# EasyEDA Pro project SAM-2.eprj, schematic Schematic, sheets 1 to 7 of 8

## Sheets
1 Universal Inputs: Board Name: SAM-2; Create Date: 2026-07-06; Page Name: Universal Inputs; Project Name: SAM-2; Schematic Name: Schematic; Update Date: 2026-07-13; Company: www.zyntellitech.com; Drawn: Stephen Long Jr; Page Size: A4; Version: V1.0
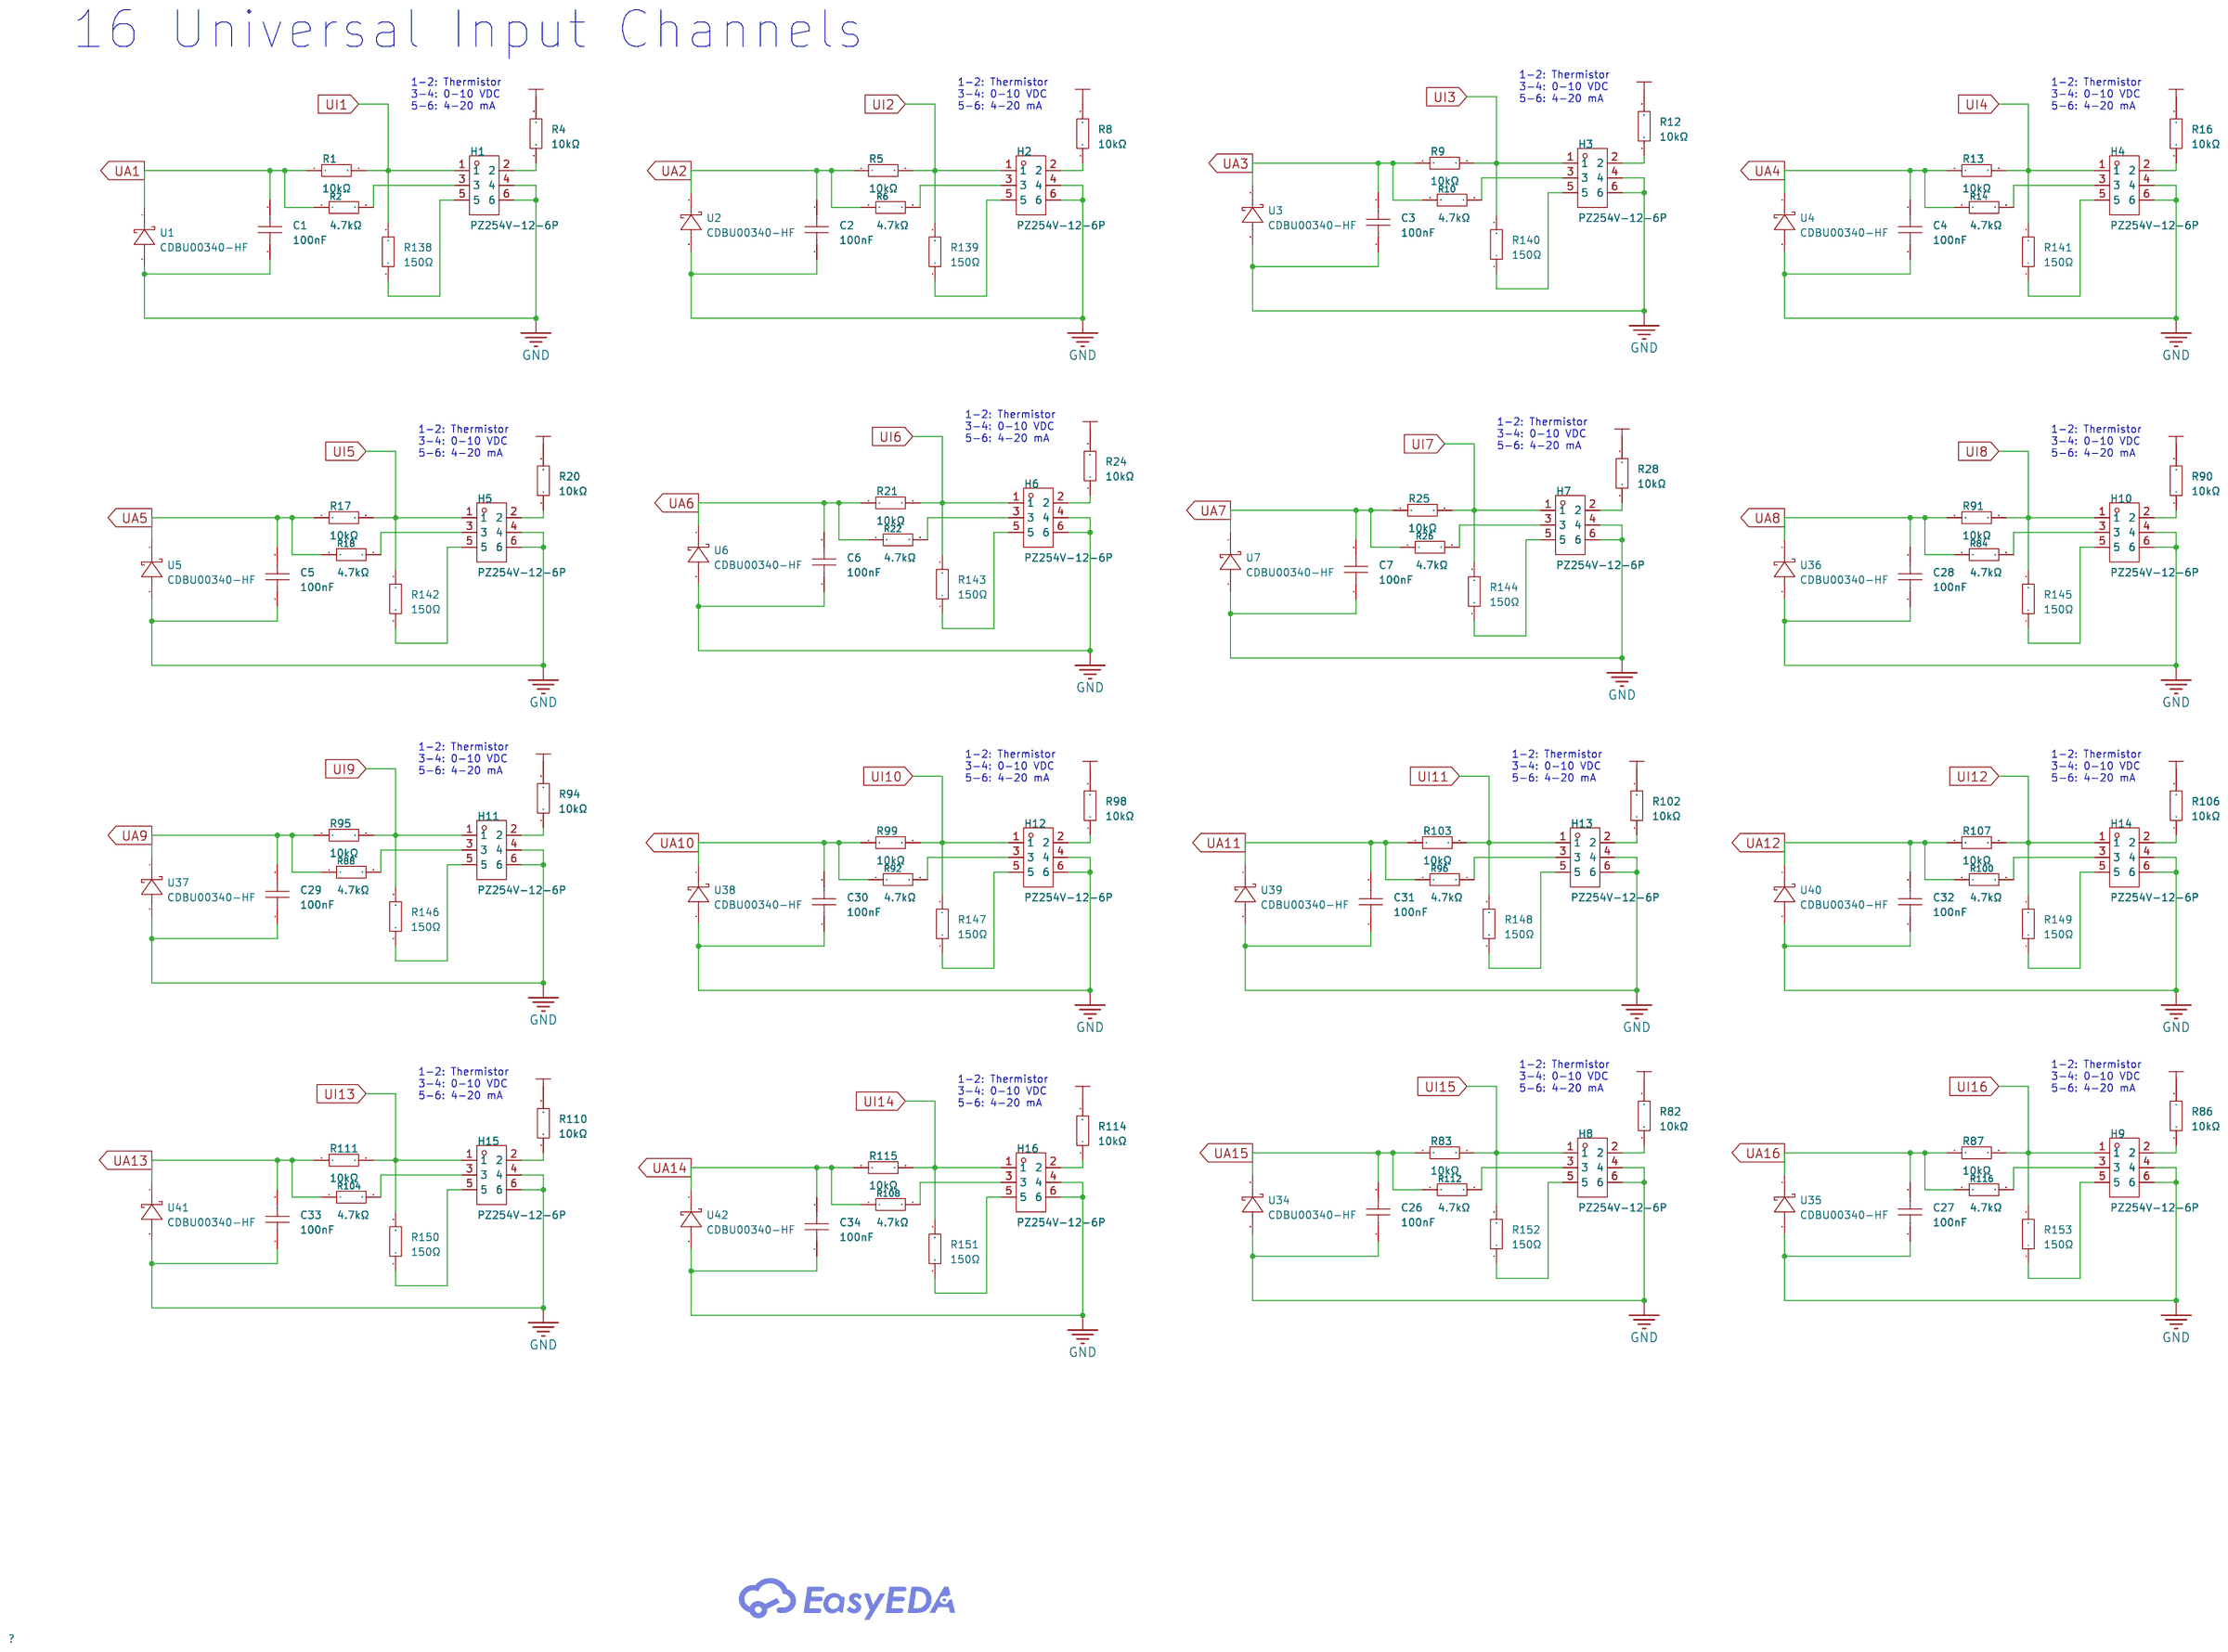
[diagram p0: Universal Inputs]
2 Analog Outputs: Create Date: 2026-07-07; Page Name: Analog Outputs; Update Date: 2026-07-08; Company: EasyEDA.com
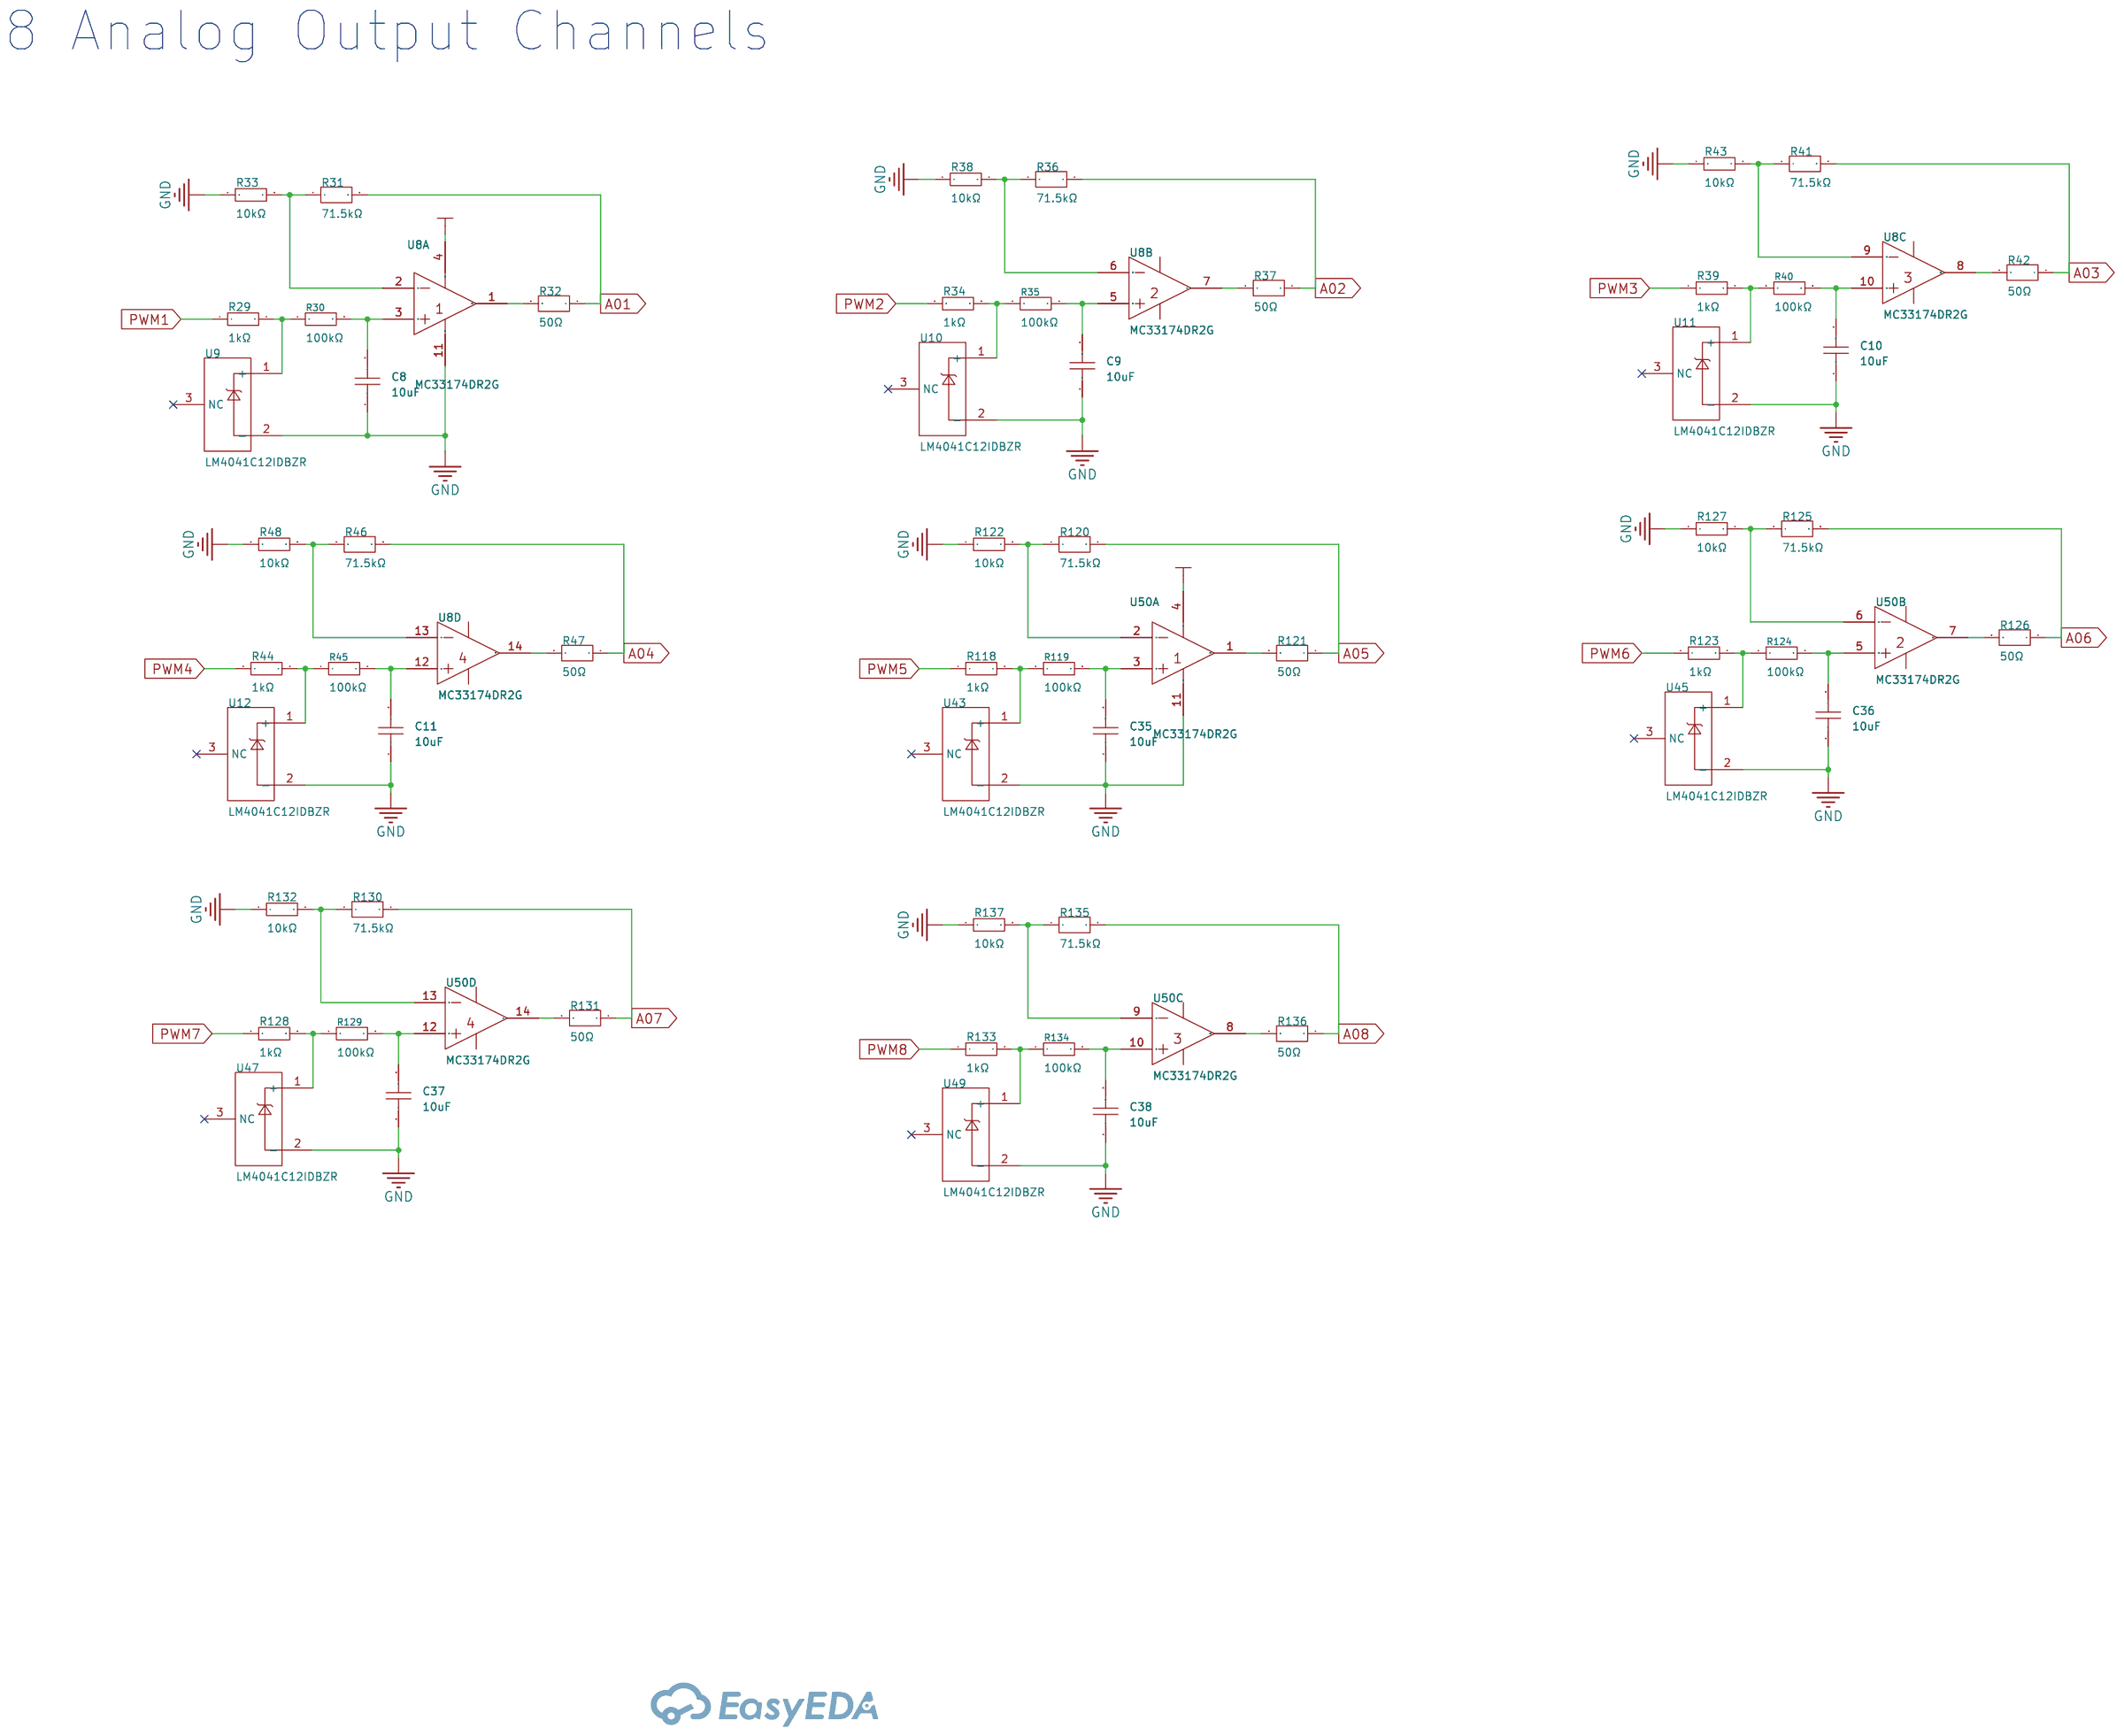
[diagram p1: Analog Outputs]
3 Triac: Create Date: 2026-07-08; Page Name: Triac; Update Date: 2026-07-08; Company: EasyEDA.com
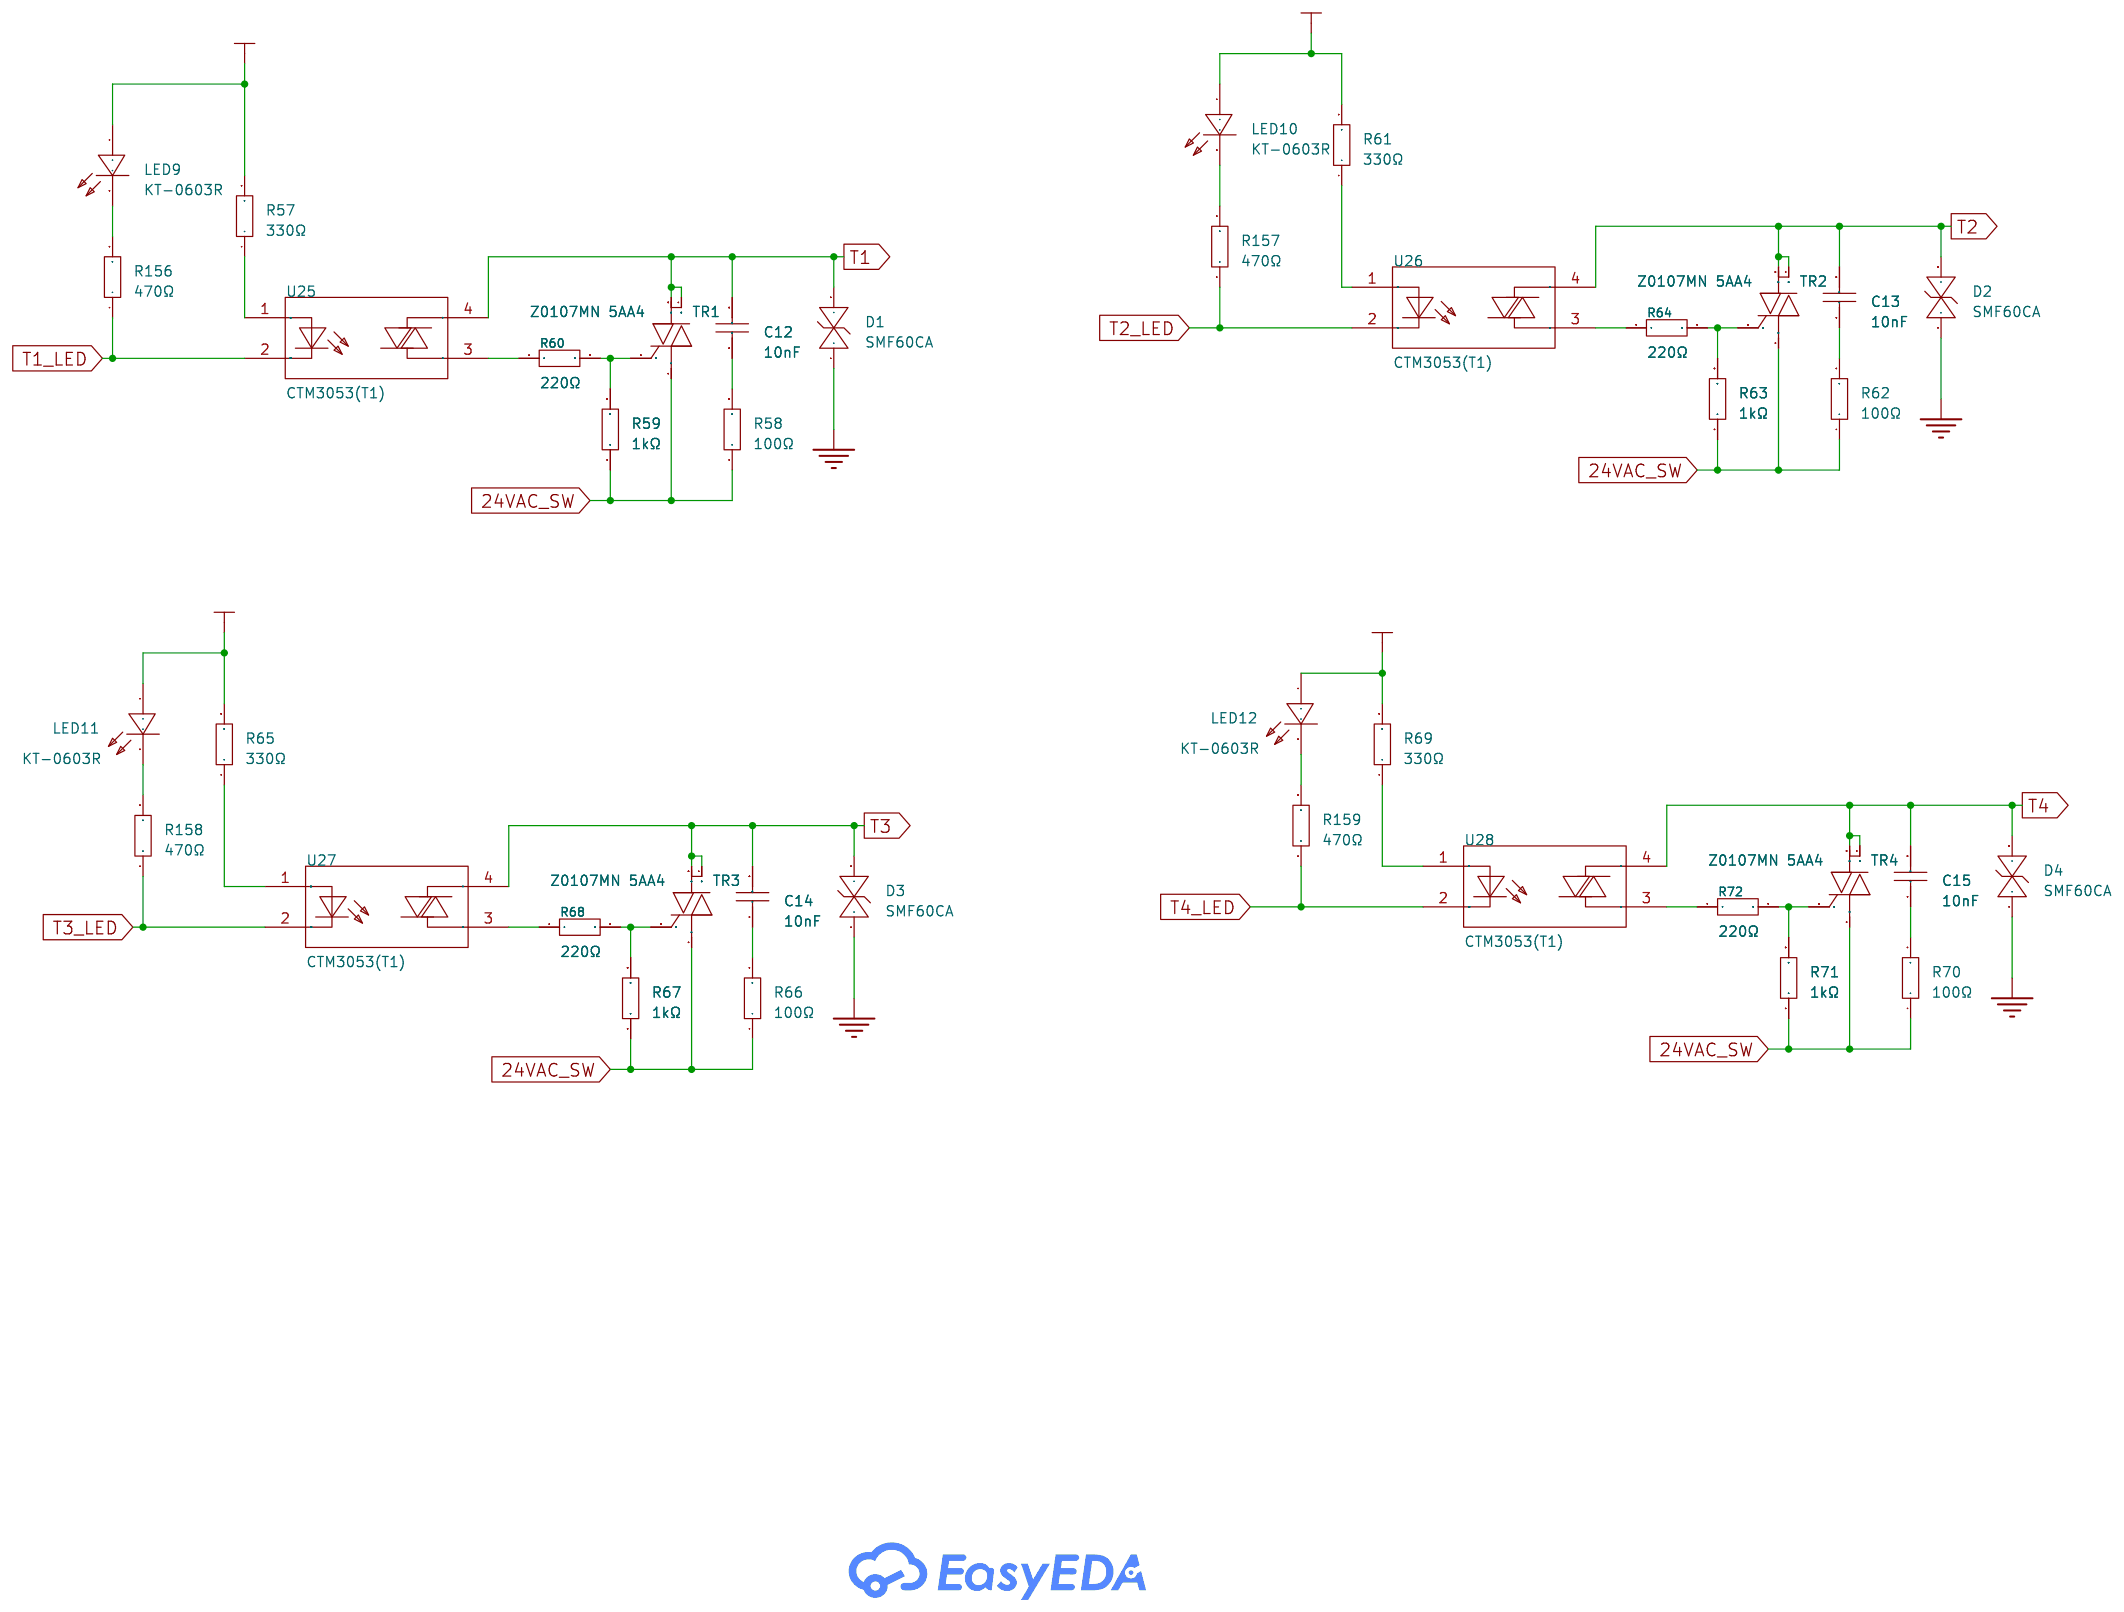
[diagram p2: Triac]
4 FastDigital: Create Date: 2026-07-08; Page Name: FastDigital; Update Date: 2026-07-08; Company: EasyEDA.com
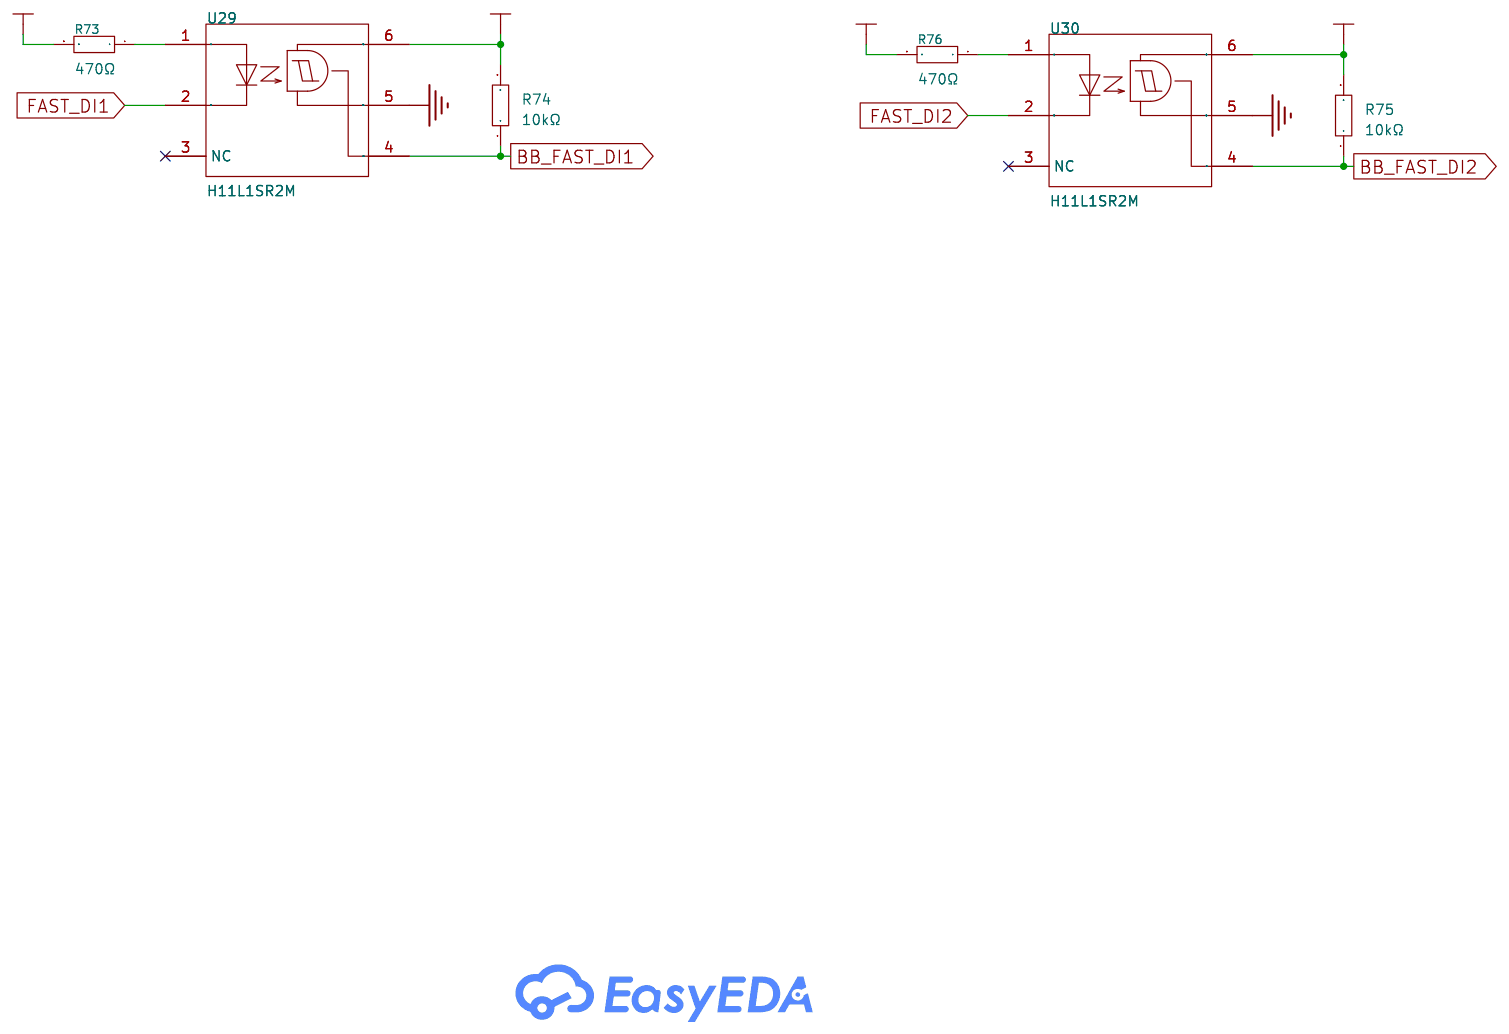
[diagram p3: FastDigital]
5 Power Circuit: Create Date: 2026-07-08; Page Name: Power Circuit; Update Date: 2026-07-15; Company: EasyEDA.com
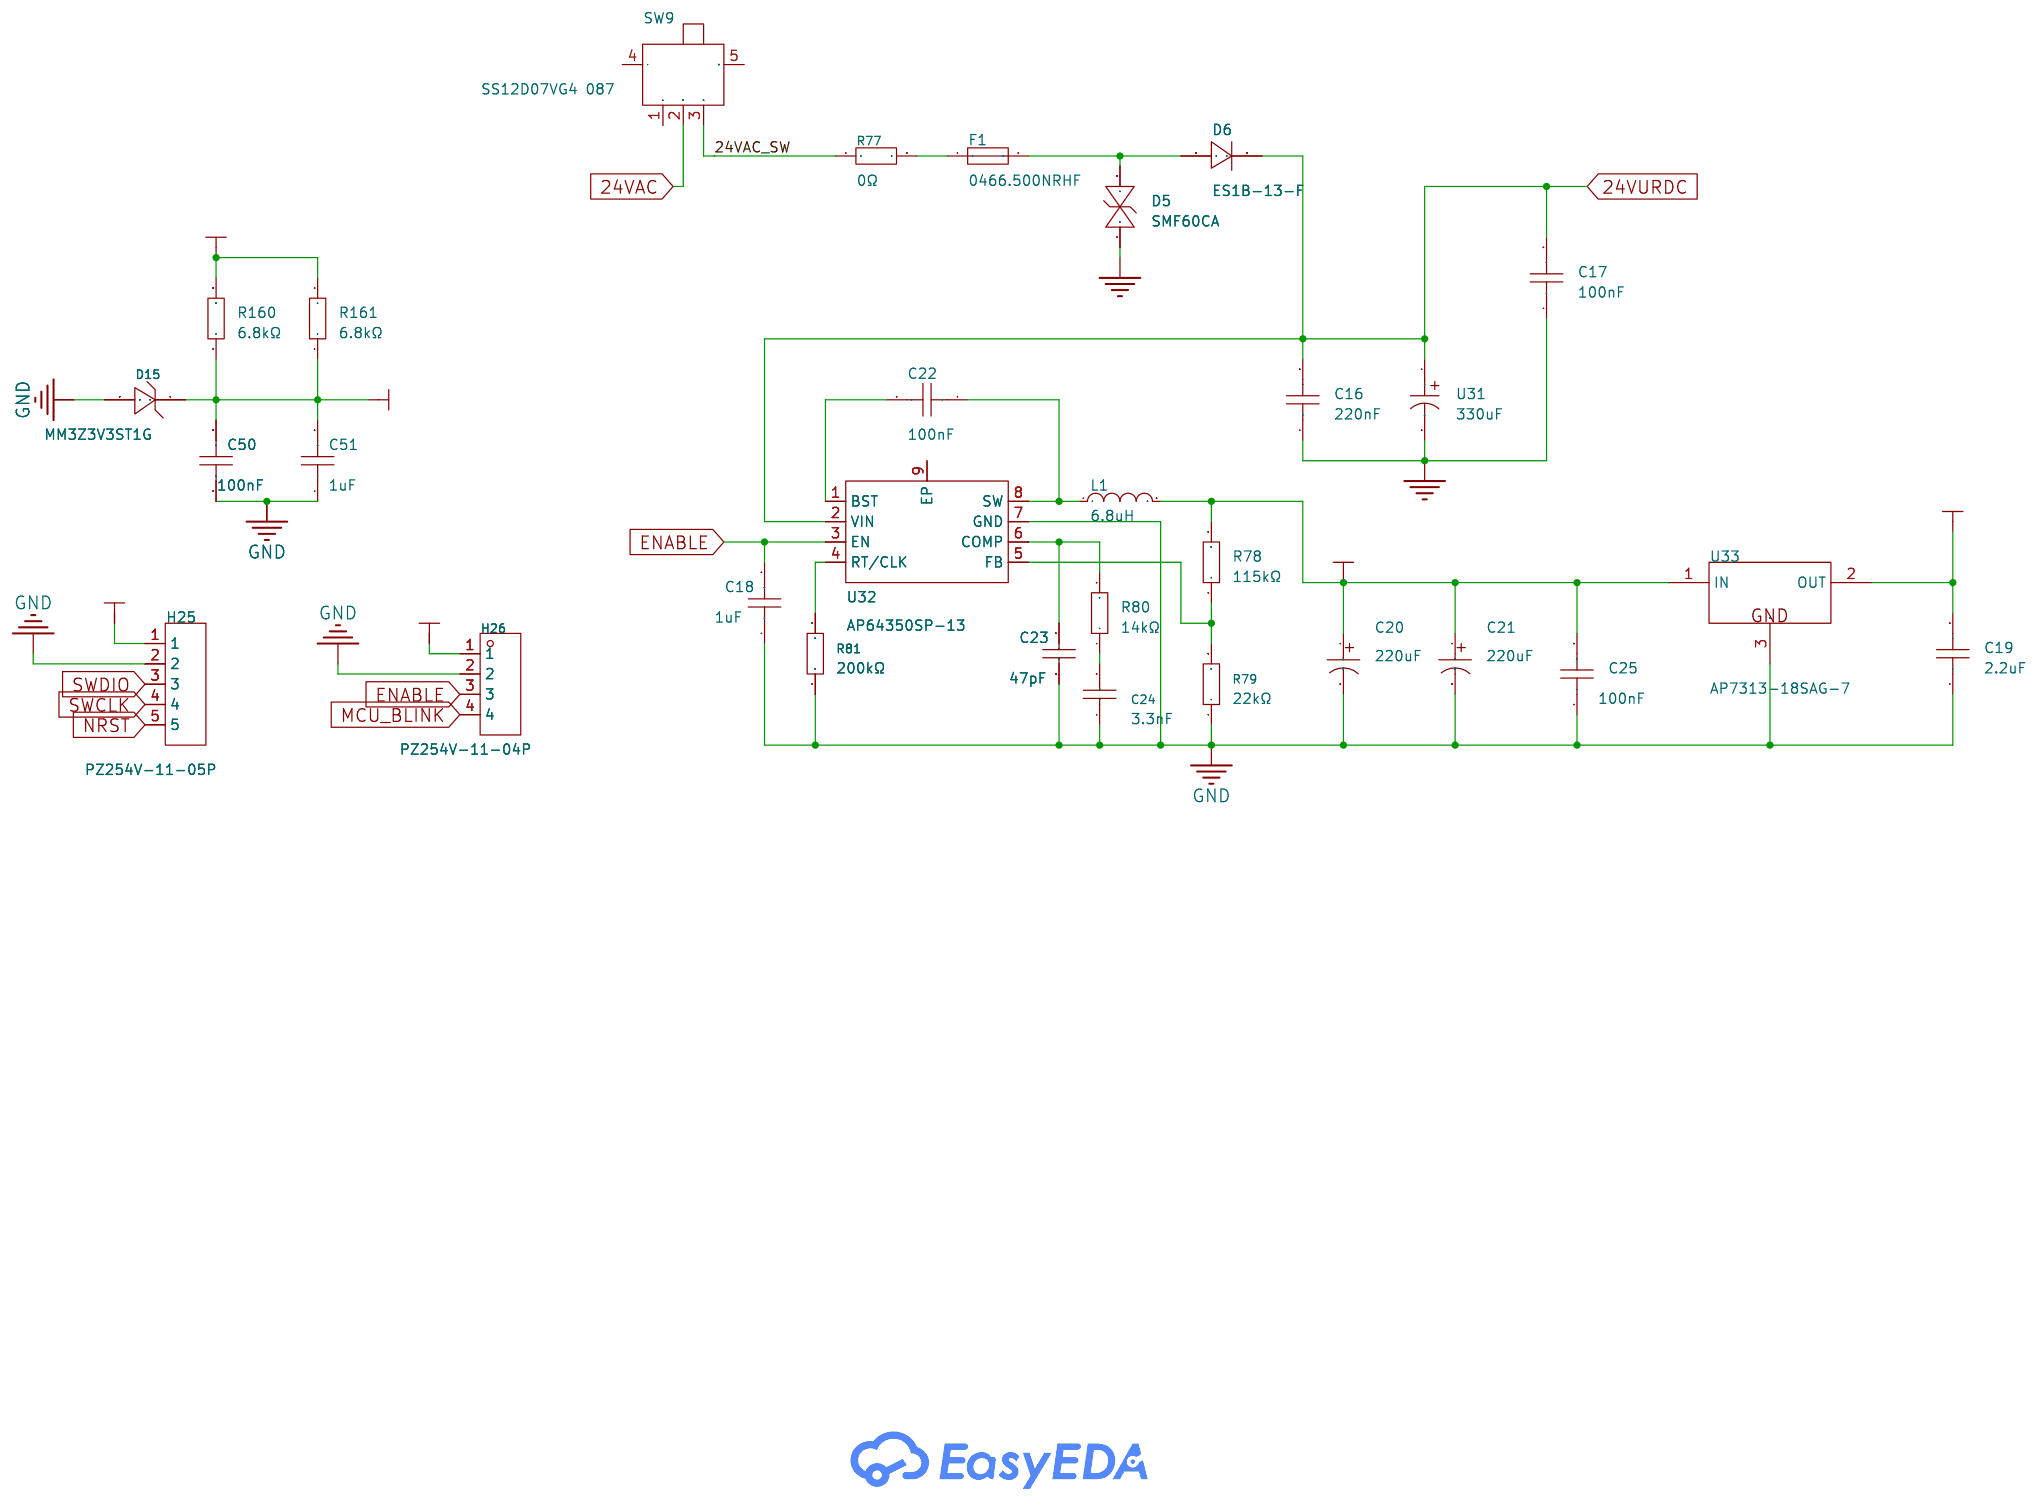
[diagram p4: Power Circuit]
6 Microcontroller: Create Date: 2026-07-09; Page Name: Microcontroller; Update Date: 2026-07-15; Company: EasyEDA.com
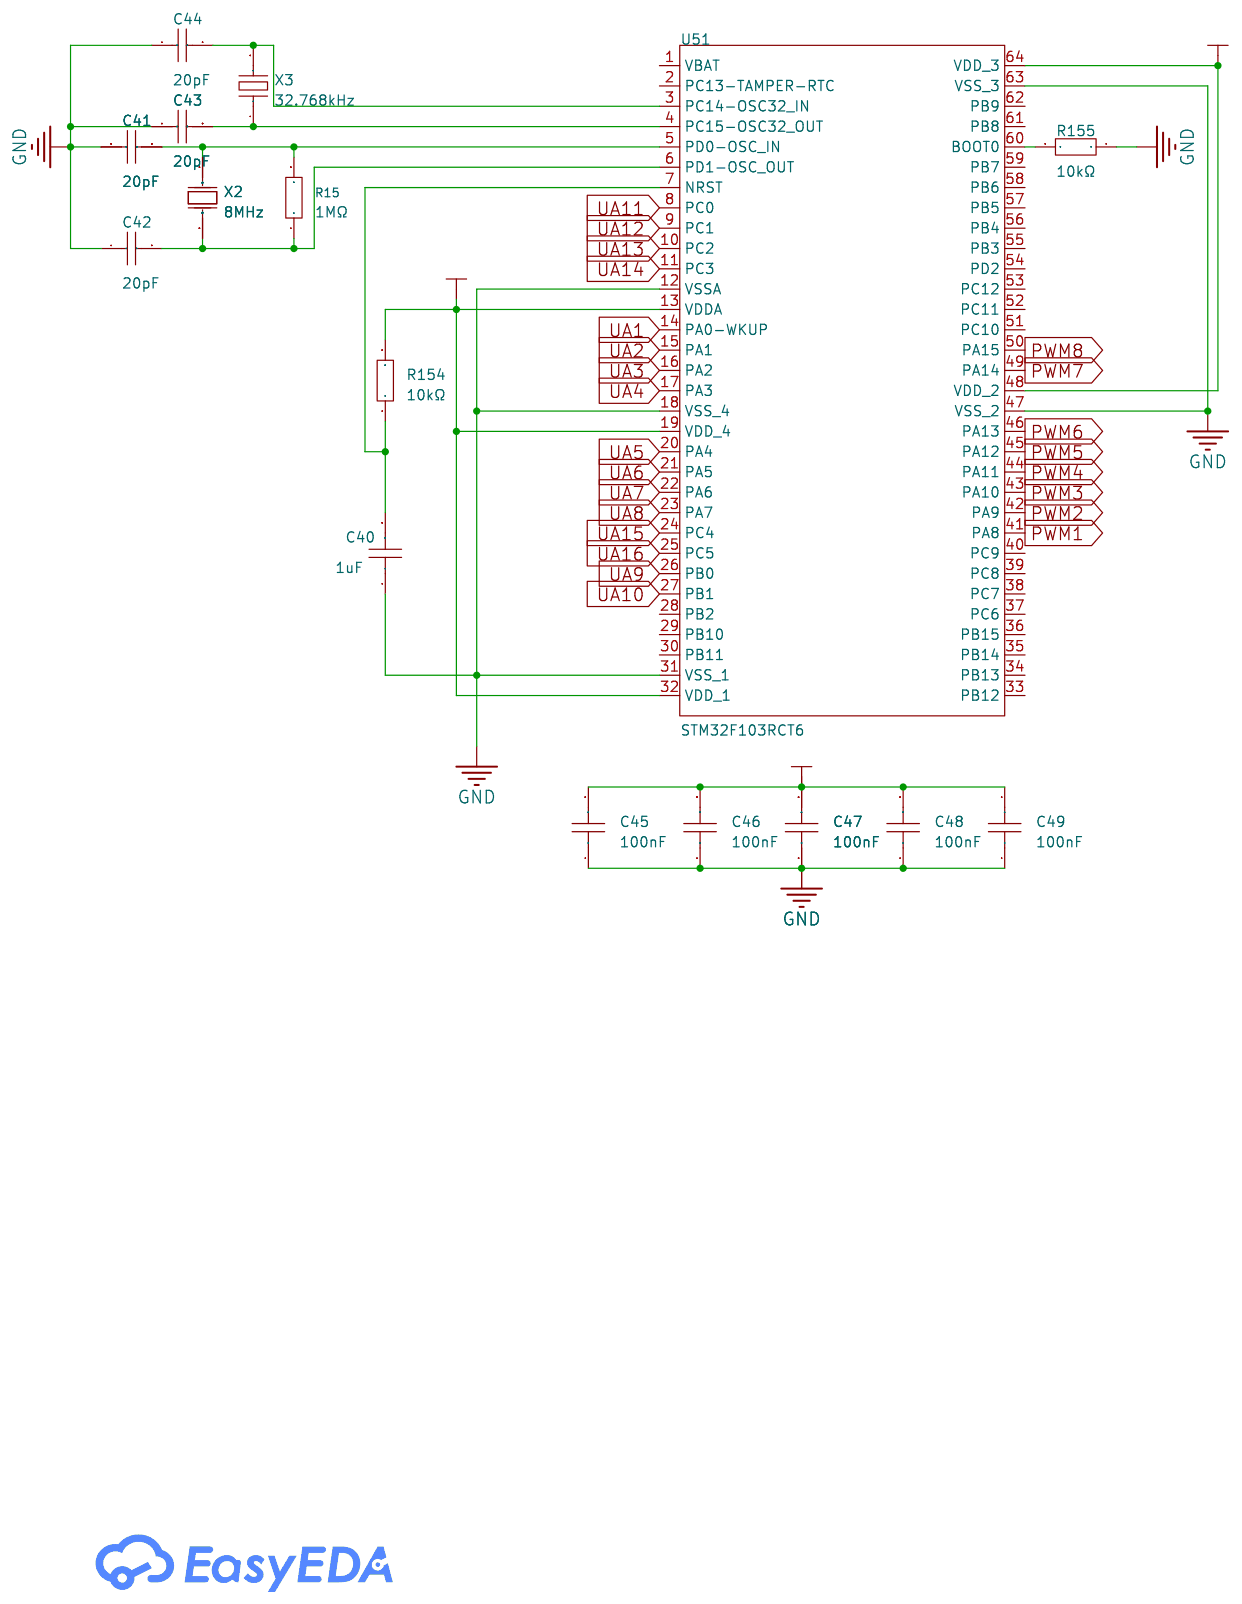
[diagram p5: Microcontroller]
7 Connectors: Create Date: 2026-07-14; Page Name: Connectors; Update Date: 2026-07-15; Company: EasyEDA.com
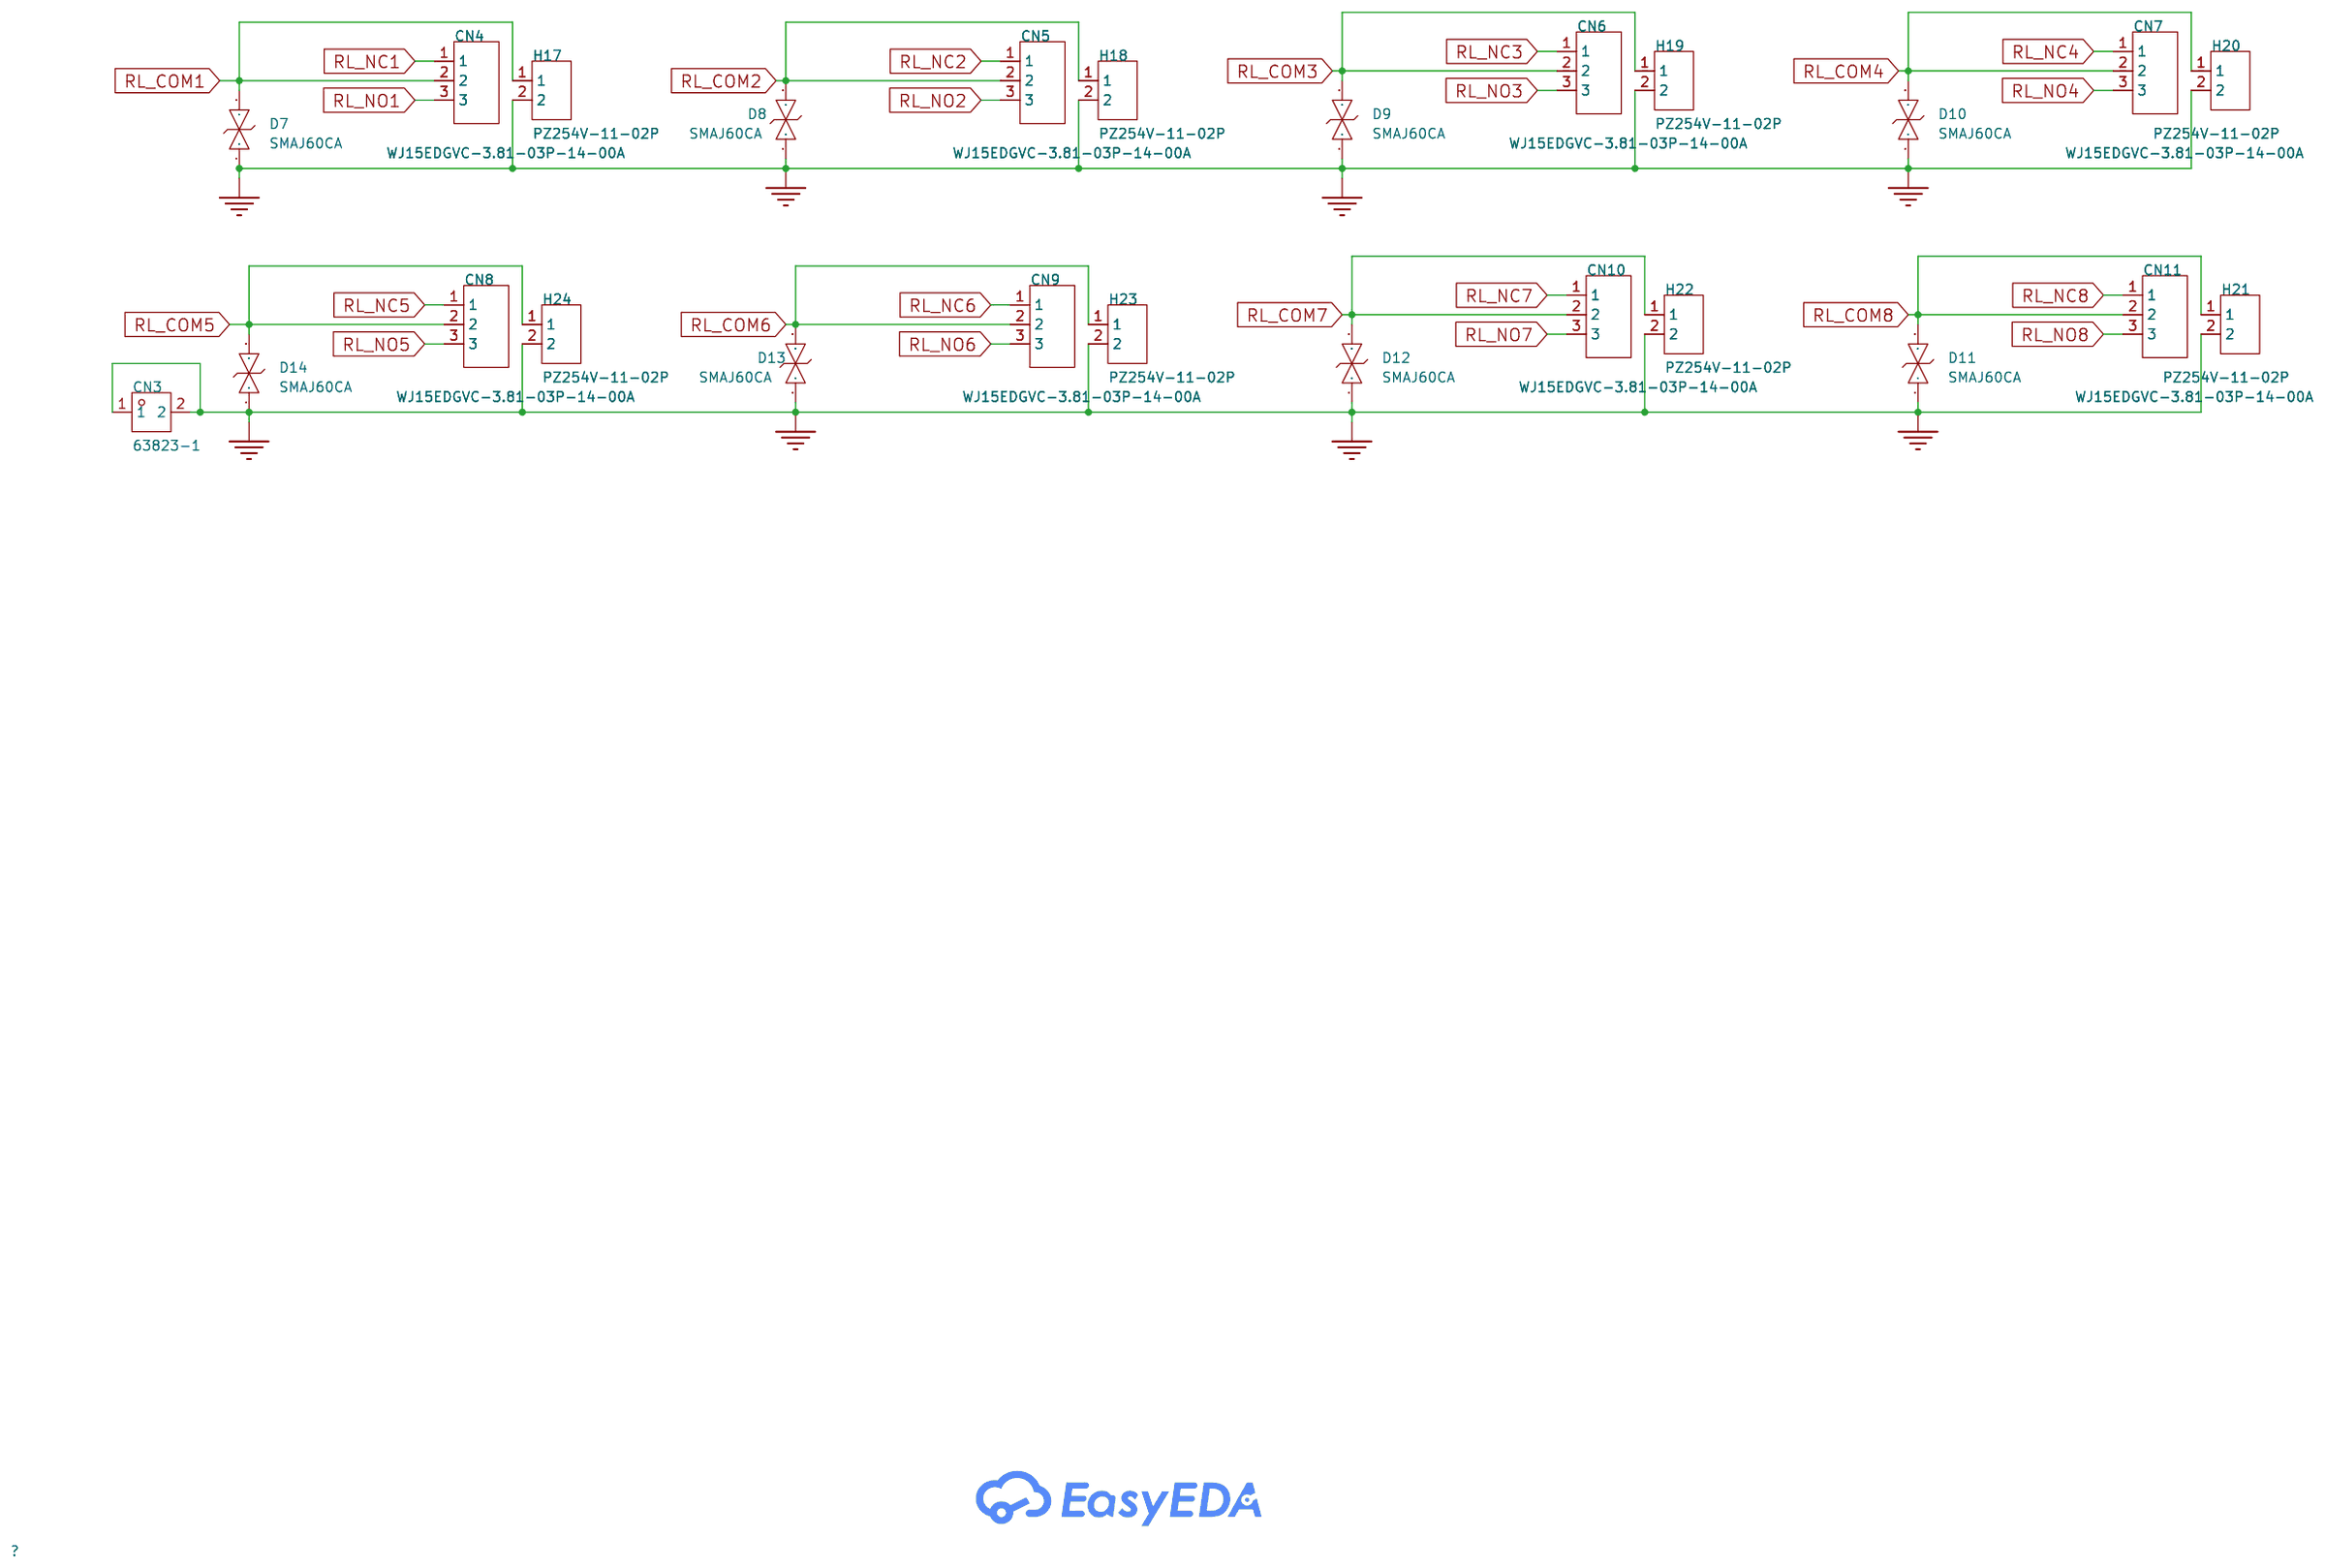
[diagram p6: Connectors]

## Parts
sheet Analog Outputs
C8  10uF  [C0402]
C9  10uF  [C0402]
C10  10uF  [C0402]
C11  10uF  [C0402]
C35  10uF  [C0402]
C36  10uF  [C0402]
C37  10uF  [C0402]
C38  10uF  [C0402]
R29  1kΩ  [R0402]
R30  100kΩ  [R0402]
R31  71.5kΩ  [R0402]
R32  50Ω  [R0603]
R33  10kΩ  [R0402]
R34  1kΩ  [R0402]
R35  100kΩ  [R0402]
R36  71.5kΩ  [R0402]
R37  50Ω  [R0603]
R38  10kΩ  [R0402]
R39  1kΩ  [R0402]
R40  100kΩ  [R0402]
R41  71.5kΩ  [R0402]
R42  50Ω  [R0603]
R43  10kΩ  [R0402]
R44  1kΩ  [R0402]
R45  100kΩ  [R0402]
R46  71.5kΩ  [R0402]
R47  50Ω  [R0603]
R48  10kΩ  [R0402]
R118  1kΩ  [R0402]
R119  100kΩ  [R0402]
R120  71.5kΩ  [R0402]
R121  50Ω  [R0603]
R122  10kΩ  [R0402]
R123  1kΩ  [R0402]
R124  100kΩ  [R0402]
R125  71.5kΩ  [R0402]
R126  50Ω  [R0603]
R127  10kΩ  [R0402]
R128  1kΩ  [R0402]
R129  100kΩ  [R0402]
R130  71.5kΩ  [R0402]
R131  50Ω  [R0603]
R132  10kΩ  [R0402]
R133  1kΩ  [R0402]
R134  100kΩ  [R0402]
R135  71.5kΩ  [R0402]
R136  50Ω  [R0603]
R137  10kΩ  [R0402]
U8  MC33174DR2G  [SOIC-14_L8.7-W3.9-P1.27-LS6.0-BL]  (sections 1,2,3,4)
U9  LM4041C12IDBZR  [SOT-23-3_L2.9-W1.6-P1.90-LS2.8-BR]
U10  LM4041C12IDBZR  [SOT-23-3_L2.9-W1.6-P1.90-LS2.8-BR]
U11  LM4041C12IDBZR  [SOT-23-3_L2.9-W1.6-P1.90-LS2.8-BR]
U12  LM4041C12IDBZR  [SOT-23-3_L2.9-W1.6-P1.90-LS2.8-BR]
U43  LM4041C12IDBZR  [SOT-23-3_L2.9-W1.6-P1.90-LS2.8-BR]
U45  LM4041C12IDBZR  [SOT-23-3_L2.9-W1.6-P1.90-LS2.8-BR]
U47  LM4041C12IDBZR  [SOT-23-3_L2.9-W1.6-P1.90-LS2.8-BR]
U49  LM4041C12IDBZR  [SOT-23-3_L2.9-W1.6-P1.90-LS2.8-BR]
U50  MC33174DR2G  [SOIC-14_L8.7-W3.9-P1.27-LS6.0-BL]  (sections 1,2,3,4)
sheet Connectors
CN3  63823-1  [CONN-TH_63823-1]
CN4  WJ15EDGVC-3.81-03P-14-00A  [CONN-TH_3P-P3.81_WJ15EDGVC-3.81-3P]
CN5  WJ15EDGVC-3.81-03P-14-00A  [CONN-TH_3P-P3.81_WJ15EDGVC-3.81-3P]
CN6  WJ15EDGVC-3.81-03P-14-00A  [CONN-TH_3P-P3.81_WJ15EDGVC-3.81-3P]
CN7  WJ15EDGVC-3.81-03P-14-00A  [CONN-TH_3P-P3.81_WJ15EDGVC-3.81-3P]
CN8  WJ15EDGVC-3.81-03P-14-00A  [CONN-TH_3P-P3.81_WJ15EDGVC-3.81-3P]
CN9  WJ15EDGVC-3.81-03P-14-00A  [CONN-TH_3P-P3.81_WJ15EDGVC-3.81-3P]
CN10  WJ15EDGVC-3.81-03P-14-00A  [CONN-TH_3P-P3.81_WJ15EDGVC-3.81-3P]
CN11  WJ15EDGVC-3.81-03P-14-00A  [CONN-TH_3P-P3.81_WJ15EDGVC-3.81-3P]
D7  SMAJ60CA  [SMA_L4.3-W2.6-LS5.1-BI]
D8  SMAJ60CA  [SMA_L4.3-W2.6-LS5.1-BI]
D9  SMAJ60CA  [SMA_L4.3-W2.6-LS5.1-BI]
D10  SMAJ60CA  [SMA_L4.3-W2.6-LS5.1-BI]
D11  SMAJ60CA  [SMA_L4.3-W2.6-LS5.1-BI]
D12  SMAJ60CA  [SMA_L4.3-W2.6-LS5.1-BI]
D13  SMAJ60CA  [SMA_L4.3-W2.6-LS5.1-BI]
D14  SMAJ60CA  [SMA_L4.3-W2.6-LS5.1-BI]
H17  PZ254V-11-02P  [HDR-TH_2P-P2.54-V-M]
H18  PZ254V-11-02P  [HDR-TH_2P-P2.54-V-M]
H19  PZ254V-11-02P  [HDR-TH_2P-P2.54-V-M]
H20  PZ254V-11-02P  [HDR-TH_2P-P2.54-V-M]
H21  PZ254V-11-02P  [HDR-TH_2P-P2.54-V-M]
H22  PZ254V-11-02P  [HDR-TH_2P-P2.54-V-M]
H23  PZ254V-11-02P  [HDR-TH_2P-P2.54-V-M]
H24  PZ254V-11-02P  [HDR-TH_2P-P2.54-V-M]
sheet FastDigital
R73  470Ω  [R0402]
R74  10kΩ  [R0402]
R75  10kΩ  [R0402]
R76  470Ω  [R0402]
U29  H11L1SR2M  [SMD-6_L8.7-W6.5-P2.54-LS10.6-BL]
U30  H11L1SR2M  [SMD-6_L8.7-W6.5-P2.54-LS10.6-BL]
sheet Microcontroller
C40  1uF  [C0603]
C41  20pF  [C0402]
C42  20pF  [C0402]
C43  20pF  [C0402]
C44  20pF  [C0402]
C45  100nF  [C0402]
C46  100nF  [C0402]
C47  100nF  [C0402]
C48  100nF  [C0402]
C49  100nF  [C0402]
R15  1MΩ  [R0402]
R154  10kΩ  [R0402]
R155  10kΩ  [R0402]
U51  STM32F103RCT6  [LQFP-64_L10.0-W10.0-P0.50-LS12.0-BL]
X2  8MHz  [CRYSTAL-SMD_L11.5-W4.8-LS12.7]
X3  32.768kHz  [OSC-TH_BD2.0-P0.70-D0.3]
sheet Power Circuit
C16  220nF  [C0402]
C17  100nF  [C0402]
C18  1uF  [C0603]
C19  2.2uF  [C0603]
C20  220uF  [CAP-SMD_BD6.3-L6.6-W6.6-FD]
C21  220uF  [CAP-SMD_BD6.3-L6.6-W6.6-FD]
C22  100nF  [C0402]
C23  47pF  [C0402]
C24  3.3nF  [C0402]
C25  100nF  [C0402]
C50  100nF  [C0402]
C51  1uF  [C0603]
D5  SMF60CA  [SOD-123FL_L2.8-W1.8-LS3.7-BI]
D6  ES1B-13-F  [SMA_L4.4-W2.8-LS5.4-RD]
D15  MM3Z3V3ST1G  [SOD-323_L1.7-W1.3-LS2.5-RD]
F1  0466.500NRHF  [F1206]
H25  PZ254V-11-05P  [HDR-TH_5P-P2.54-V-M]
H26  PZ254V-11-04P  [HDR-TH_4P-P2.54-V-M]
L1  6.8uH  [IND-SMD_L5.8-W5.2]
R77  0Ω  [R0603]
R78  115kΩ  [R0402]
R79  22kΩ  [R0402]
R80  14kΩ  [R0402]
R81  200kΩ  [R0402]
R160  6.8kΩ  [R0402]
R161  6.8kΩ  [R0402]
SW9  SS12D07VG4 087  [SW-TH_SS12D07VG4]
U31  330uF  [CAP-SMD_BD10.0-L10.3-W10.3-LS11.3-FD]
U32  AP64350SP-13  [SO-8_L4.9-W3.9-P1.27-LS6.0-BL-EP]
U33  AP7313-18SAG-7  [SOT-23-3_L2.9-W1.3-P1.90-LS2.4-BR]
sheet Triac
C12  10nF  [C0603]
C13  10nF  [C0603]
C14  10nF  [C0603]
C15  10nF  [C0603]
D1  SMF60CA  [SOD-123FL_L2.8-W1.8-LS3.7-BI]
D2  SMF60CA  [SOD-123FL_L2.8-W1.8-LS3.7-BI]
D3  SMF60CA  [SOD-123FL_L2.8-W1.8-LS3.7-BI]
D4  SMF60CA  [SOD-123FL_L2.8-W1.8-LS3.7-BI]
LED9  KT-0603R  [LED-SMD_L1.6-W0.8-R-RD]
LED10  KT-0603R  [LED-SMD_L1.6-W0.8-R-RD]
LED11  KT-0603R  [LED-SMD_L1.6-W0.8-R-RD]
LED12  KT-0603R  [LED-SMD_L1.6-W0.8-R-RD]
R57  330Ω  [R0603]
R58  100Ω  [R0603]
R59  1kΩ  [R0603]
R60  220Ω  [R0603]
R61  330Ω  [R0603]
R62  100Ω  [R0603]
R63  1kΩ  [R0603]
R64  220Ω  [R0603]
R65  330Ω  [R0603]
R66  100Ω  [R0603]
R67  1kΩ  [R0603]
R68  220Ω  [R0603]
R69  330Ω  [R0603]
R70  100Ω  [R0603]
R71  1kΩ  [R0603]
R72  220Ω  [R0603]
R156  470Ω  [R0603]
R157  470Ω  [R0603]
R158  470Ω  [R0603]
R159  470Ω  [R0603]
TR1  Z0107MN 5AA4  [SOT-223_L6.7-W3.5-P2.30-BR]
TR2  Z0107MN 5AA4  [SOT-223_L6.7-W3.5-P2.30-BR]
TR3  Z0107MN 5AA4  [SOT-223_L6.7-W3.5-P2.30-BR]
TR4  Z0107MN 5AA4  [SOT-223_L6.7-W3.5-P2.30-BR]
U25  CTM3053(T1)  [SOP-4_L3.6-W4.4-P2.54-LS7.0-TL]
U26  CTM3053(T1)  [SOP-4_L3.6-W4.4-P2.54-LS7.0-TL]
U27  CTM3053(T1)  [SOP-4_L3.6-W4.4-P2.54-LS7.0-TL]
U28  CTM3053(T1)  [SOP-4_L3.6-W4.4-P2.54-LS7.0-TL]
sheet Universal Inputs
C1  100nF  [C0402]
C2  100nF  [C0402]
C3  100nF  [C0402]
C4  100nF  [C0402]
C5  100nF  [C0402]
C6  100nF  [C0402]
C7  100nF  [C0402]
C26  100nF  [C0402]
C27  100nF  [C0402]
C28  100nF  [C0402]
C29  100nF  [C0402]
C30  100nF  [C0402]
C31  100nF  [C0402]
C32  100nF  [C0402]
C33  100nF  [C0402]
C34  100nF  [C0402]
H1  PZ254V-12-6P  [HDR-TH_6P-P2.54-V-M-R2-C3-S2.54]
H2  PZ254V-12-6P  [HDR-TH_6P-P2.54-V-M-R2-C3-S2.54]
H3  PZ254V-12-6P  [HDR-TH_6P-P2.54-V-M-R2-C3-S2.54]
H4  PZ254V-12-6P  [HDR-TH_6P-P2.54-V-M-R2-C3-S2.54]
H5  PZ254V-12-6P  [HDR-TH_6P-P2.54-V-M-R2-C3-S2.54]
H6  PZ254V-12-6P  [HDR-TH_6P-P2.54-V-M-R2-C3-S2.54]
H7  PZ254V-12-6P  [HDR-TH_6P-P2.54-V-M-R2-C3-S2.54]
H8  PZ254V-12-6P  [HDR-TH_6P-P2.54-V-M-R2-C3-S2.54]
H9  PZ254V-12-6P  [HDR-TH_6P-P2.54-V-M-R2-C3-S2.54]
H10  PZ254V-12-6P  [HDR-TH_6P-P2.54-V-M-R2-C3-S2.54]
H11  PZ254V-12-6P  [HDR-TH_6P-P2.54-V-M-R2-C3-S2.54]
H12  PZ254V-12-6P  [HDR-TH_6P-P2.54-V-M-R2-C3-S2.54]
H13  PZ254V-12-6P  [HDR-TH_6P-P2.54-V-M-R2-C3-S2.54]
H14  PZ254V-12-6P  [HDR-TH_6P-P2.54-V-M-R2-C3-S2.54]
H15  PZ254V-12-6P  [HDR-TH_6P-P2.54-V-M-R2-C3-S2.54]
H16  PZ254V-12-6P  [HDR-TH_6P-P2.54-V-M-R2-C3-S2.54]
R1  10kΩ  [R0402]
R2  4.7kΩ  [R0402]
R4  10kΩ  [R0402]
R5  10kΩ  [R0402]
R6  4.7kΩ  [R0402]
R8  10kΩ  [R0402]
R9  10kΩ  [R0402]
R10  4.7kΩ  [R0402]
R12  10kΩ  [R0402]
R13  10kΩ  [R0402]
R14  4.7kΩ  [R0402]
R16  10kΩ  [R0402]
R17  10kΩ  [R0402]
R18  4.7kΩ  [R0402]
R20  10kΩ  [R0402]
R21  10kΩ  [R0402]
R22  4.7kΩ  [R0402]
R24  10kΩ  [R0402]
R25  10kΩ  [R0402]
R26  4.7kΩ  [R0402]
R28  10kΩ  [R0402]
R82  10kΩ  [R0402]
R83  10kΩ  [R0402]
R84  4.7kΩ  [R0402]
R86  10kΩ  [R0402]
R87  10kΩ  [R0402]
R88  4.7kΩ  [R0402]
R90  10kΩ  [R0402]
R91  10kΩ  [R0402]
R92  4.7kΩ  [R0402]
R94  10kΩ  [R0402]
R95  10kΩ  [R0402]
R96  4.7kΩ  [R0402]
R98  10kΩ  [R0402]
R99  10kΩ  [R0402]
R100  4.7kΩ  [R0402]
R102  10kΩ  [R0402]
R103  10kΩ  [R0402]
R104  4.7kΩ  [R0402]
R106  10kΩ  [R0402]
R107  10kΩ  [R0402]
R108  4.7kΩ  [R0402]
R110  10kΩ  [R0402]
R111  10kΩ  [R0402]
R112  4.7kΩ  [R0402]
R114  10kΩ  [R0402]
R115  10kΩ  [R0402]
R116  4.7kΩ  [R0402]
R138  150Ω  [R0402]
R139  150Ω  [R0402]
R140  150Ω  [R0402]
R141  150Ω  [R0402]
R142  150Ω  [R0402]
R143  150Ω  [R0402]
R144  150Ω  [R0402]
R145  150Ω  [R0402]
R146  150Ω  [R0402]
R147  150Ω  [R0402]
R148  150Ω  [R0402]
R149  150Ω  [R0402]
R150  150Ω  [R0402]
R151  150Ω  [R0402]
R152  150Ω  [R0402]
R153  150Ω  [R0402]
U1  CDBU00340-HF  [SOD-523F_L1.7-W0.9-LS1.7-RD]
U2  CDBU00340-HF  [SOD-523F_L1.7-W0.9-LS1.7-RD]
U3  CDBU00340-HF  [SOD-523F_L1.7-W0.9-LS1.7-RD]
U4  CDBU00340-HF  [SOD-523F_L1.7-W0.9-LS1.7-RD]
U5  CDBU00340-HF  [SOD-523F_L1.7-W0.9-LS1.7-RD]
U6  CDBU00340-HF  [SOD-523F_L1.7-W0.9-LS1.7-RD]
U7  CDBU00340-HF  [SOD-523F_L1.7-W0.9-LS1.7-RD]
U34  CDBU00340-HF  [SOD-523F_L1.7-W0.9-LS1.7-RD]
U35  CDBU00340-HF  [SOD-523F_L1.7-W0.9-LS1.7-RD]
U36  CDBU00340-HF  [SOD-523F_L1.7-W0.9-LS1.7-RD]
U37  CDBU00340-HF  [SOD-523F_L1.7-W0.9-LS1.7-RD]
U38  CDBU00340-HF  [SOD-523F_L1.7-W0.9-LS1.7-RD]
U39  CDBU00340-HF  [SOD-523F_L1.7-W0.9-LS1.7-RD]
U40  CDBU00340-HF  [SOD-523F_L1.7-W0.9-LS1.7-RD]
U41  CDBU00340-HF  [SOD-523F_L1.7-W0.9-LS1.7-RD]
U42  CDBU00340-HF  [SOD-523F_L1.7-W0.9-LS1.7-RD]

## Library data of the parts
C8-C11 C35-C38 = CL05A106MP5NUNC_C315248: LCSC Part Name: 10uF ±20% 10V; Supplier Part: C315248; Manufacturer: SAMSUNG(三星); Manufacturer Part: CL05A106MP5NUNC; Supplier Footprint: 0402; JLCPCB Part Class: Extended Part; Datasheet: https://item.szlcsc.com/datasheet/CL05A106MP5NUNC/297154.html; Supplier: LCSC; Tolerance: ±20%; Voltage Rating: 10V; Temperature Coefficient: X5R
R29 R34 R39 R44 R118 R123 R128 R133 = 0402WGF1001TCE: LCSC Part Name: 1kΩ ±1% 62.5mW 厚膜电阻; Supplier Part: C11702; Manufacturer: UNI-ROYAL(厚声); Supplier Footprint: 0402; JLCPCB Part Class: Basic Part; Datasheet: https://item.szlcsc.com/datasheet/0402WGF1001TCE/12256.html; Supplier: LCSC; Type: Thick Film Resistor; Tolerance: ±1%; Power(Watts): 62.5mW; Voltage-Supply(Max): 50V; Temperature Coefficient: ±100ppm/℃; Operating Temperature: -55℃~+155℃
R30 R35 R40 R45 R119 R124 R129 R134 = 0402WGF1003TCE: LCSC Part Name: 100kΩ ±1% 62.5mW 厚膜电阻; Supplier Part: C25741; Manufacturer: UNI-ROYAL(厚声); Supplier Footprint: 0402; JLCPCB Part Class: Basic Part; Datasheet: https://item.szlcsc.com/datasheet/0402WGF1003TCE/26484.html; Supplier: LCSC; Type: Thick Film Resistor; Tolerance: ±1%; Power(Watts): 62.5mW; Voltage-Supply(Max): 50V; Temperature Coefficient: ±100ppm/℃; Operating Temperature: -55℃~+155℃
R31 R36 R41 R46 R120 R125 R130 R135 = RT0402BRD0771K5L: LCSC Part Name: 薄膜电阻 71.5kΩ ±0.1% 62.5mW; Supplier Part: C852906; Manufacturer: YAGEO(国巨); Supplier Footprint: 0402; JLCPCB Part Class: Extended Part; Datasheet: https://item.szlcsc.com/datasheet/RT0402BRD0771K5L/913228.html; Supplier: LCSC; Type: Thin Film Resistor; Tolerance: ±0.1%; Power(Watts): 62.5mW; Voltage-Supply(Max): 50V; Temperature Coefficient: ±25ppm/℃; Operating Temperature: -55℃~+155℃
R32 R37 R42 R47 R121 R126 R131 R136 = RT0603BRE0750RL: LCSC Part Name: 薄膜电阻 50Ω ±0.1% 100mW; Supplier Part: C849792; Manufacturer: YAGEO(国巨); Supplier Footprint: 0603; JLCPCB Part Class: Extended Part; Datasheet: https://item.szlcsc.com/datasheet/RT0603BRE0750RL/922274.html; Supplier: LCSC; Type: Thin Film Resistor; Tolerance: ±0.1%; Power(Watts): 100mW; Voltage-Supply(Max): 75V; Temperature Coefficient: ±50ppm/℃; Operating Temperature: -55℃~+155℃
R1 R4 R5 R8 R9 R12 R13 R16 R17 R20 R21 R24 R25 R28 R33 R38 R43 R48 R74 R75 R82 R83 R86 R87 R90 R91 R94 R95 R98 R99 R102 R103 R106 R107 R110 R111 R114 R115 R122 R127 R132 R137 R154 R155 = 0402WGF1002TCE: LCSC Part Name: 10kΩ ±1% 62.5mW 厚膜电阻; Supplier Part: C25744; Manufacturer: UNI-ROYAL(厚声); Supplier Footprint: 0402; JLCPCB Part Class: Basic Part; Datasheet: https://item.szlcsc.com/datasheet/0402WGF1002TCE/26487.html; Supplier: LCSC; Type: Thick Film Resistor; Tolerance: ±1%; Power(Watts): 62.5mW; Voltage-Supply(Max): 50V; Temperature Coefficient: ±100ppm/℃; Operating Temperature: -55℃~+155℃
U8 U50 = MC33174DR2G: LCSC Part Name: 单电源3.0 V至44 V低功耗运算放大器; Supplier Part: C113552; Manufacturer: onsemi(安森美); Supplier Footprint: SOIC-14; JLCPCB Part Class: Extended Part; Datasheet: https://item.szlcsc.com/datasheet/MC33174DR2G/114787.html; Supplier: LCSC; Number of Channels: 4; Maximum Power Supply Range (Vdd-Vss): 44V; Gain Bandwidth Product: 1.8MHz; Vos - Input Offset Voltage: 2mV; Input Offset Voltage Drift(Vos TC): 10uV/℃; Slew Rate: 2.1V/us; Ib - Input Bias Current: 20nA; Input Offset Current(Ios): 20nA; Input Voltage Noise Density: 32nV/√Hz@1kHz; Common Mode Rejection Ratio(CMRR): 90dB; Quiescent Current: 180uA; Output Current: 27mA; Operating Temperature: -40℃~+85℃; Single supply: 3V~44V; Dual Supply: -22V~-1.5V；1.5V~22V
U9-U12 U43 U45 U47 U49 = LM4041C12IDBZR: LCSC Part Name: 并联 45uA 100ppm/℃; Supplier Part: C133587; Manufacturer: TI(德州仪器); Supplier Footprint: SOT-23; JLCPCB Part Class: Extended Part; Datasheet: https://www.ti.com/cn/lit/gpn/lm4041b; Supplier: LCSC; Output Type: Fixed; Output Voltage: 1.225V; Output Current: 12mA; Tolerance: ±0.5%; Temperature Coefficient: 100ppm/℃; Reference Type: Parallel; Quiescent Current: 45uA; Minimum Cathode Current for Regulation: 80uA; Noise - 10Hz to 10kHz: 20uVrms; Operating Temperature: -40℃~+85℃@(Ta)
CN3 = 63823-1: Supplier Part: C532213; Manufacturer: TE Connectivity(泰科电子); Supplier Footprint: 插件; JLCPCB Part Class: Extended Part; Datasheet: https://item.szlcsc.com/datasheet/63823-1/552374.html; Supplier: LCSC; Blade Width: 4.75mm; Number of Inserts: 1; Number of Leg: 2; Supplementary Features: With positioning; Body Material: Copper; Ontology Coating: Tin
CN4-CN11 = WJ15EDGVC-3.81-03P-14-00A: LCSC Part Name: 卡扣固定 1x3P 3.81mm 排数:1 每排P数:3; Supplier Part: C8389; Manufacturer: KANGNEX(康奈克斯电气); Supplier Footprint: 插件,P=3.81mm; JLCPCB Part Class: Extended Part; Datasheet: https://item.szlcsc.com/datasheet/WJ15EDGVC-3.81-03P-14-00A/8883.html; Supplier: LCSC; Connector Type: Board Side/Socket - Closed; Termination Style: Hinged (Snap On); Number of Positions or Pins: 1x3P; Pitch: 3.81mm; Color: Green; Mounting Type: Through Hole; Number of Pins: 3P; Number of Rows: 1; Number of PINs Per Row: 3; Current Rating: 8A; Voltage Rating (Max): 300V; Operating Temperature: -40℃~+105℃
D7-D14 = SMAJ60CA_C152111: LCSC Part Name: TVS 60V截止 4.1A峰值脉冲; Supplier Part: C152111; Manufacturer: BORN(伯恩半导体); Supplier Footprint: SMA(DO-214AC); JLCPCB Part Class: Extended Part; Datasheet: https://item.szlcsc.com/datasheet/SMAJ60CA/163451.html; Supplier: LCSC; Polarity: Bidirectional; Reverse Stand-Off Voltage (Vrwm): 60V; Clamping Voltage: 96.8V; Peak Pulse Current (Ipp): 4.1A@10/1000us; Peak Pulse Power Dissipation (Ppp): 400W@10/1000us; Voltage - Breakdown: 73.7V; Reverse Leakage Current (Ir): 1uA; Type: TVS
H17-H24 = PZ254V-11-02P: LCSC Part Name: 1x2P 间距:2.54mm 方针 直插; Supplier Part: C492401; Manufacturer: XFCN(兴飞); Supplier Footprint: 插件,P=2.54mm; JLCPCB Part Class: Extended Part; Datasheet: https://item.szlcsc.com/datasheet/PZ254V-11-02P/502957.html; Supplier: LCSC; Pin Structure: 1x2P; Pitch: 2.54mm; Circluar Pins/Square Pins: Pin Header; Mounting Type: Through Hole; Number of Rows: 1; Number of Pins: 2P; Current Rating: 3A; Voltage Rating (Max): 250V; Length of Mating Pin: 6mm; Insulation Height: 2.5mm; Length of End Connection Pin: 3mm; Contact Material: Brass; Operating Temperature: -40℃~+105℃; Color: Black
R73 R76 = 0402WGF4700TCE: LCSC Part Name: 470Ω ±1% 62.5mW 厚膜电阻; Supplier Part: C25117; Manufacturer: UNI-ROYAL(厚声); Supplier Footprint: 0402; JLCPCB Part Class: Basic Part; Datasheet: https://item.szlcsc.com/datasheet/0402WGF4700TCE/25860.html; Supplier: LCSC; Type: Thick Film Resistor; Tolerance: ±1%; Power(Watts): 62.5mW; Voltage-Supply(Max): 50V; Temperature Coefficient: ±100ppm/℃; Operating Temperature: -55℃~+155℃
U29 U30 = H11L1SR2M: LCSC Part Name: DC输入 1通道 隔离电压(rms):4170V; Supplier Part: C20082; Manufacturer: onsemi(安森美); Supplier Footprint: SOP-6-2.54mm; JLCPCB Part Class: Extended Part; Datasheet: https://atta.szlcsc.com/upload/public/pdf/source/20170508/1494211009819.pdf; Supplier: LCSC; Input Type: DC; Supply Voltage: 3V~15V; Isolation Voltage(rms): 4.17kV; Number of Channels: 1; Operating Temperature: -40℃~+85℃
C18 C40 C51 = CL10A105KB8NNNC: LCSC Part Name: 1uF ±10% 50V; Supplier Part: C15849; Manufacturer: SAMSUNG(三星); Supplier Footprint: 0603; JLCPCB Part Class: Basic Part; Datasheet: https://item.szlcsc.com/datasheet/CL10A105KB8NNNC/16531.html; Supplier: LCSC; Tolerance: ±10%; Voltage Rating: 50V; Temperature Coefficient: X5R
C41-C44 = 0402CG200J500NT: LCSC Part Name: 20pF ±5% 50V; Supplier Part: C1554; Manufacturer: FH(风华); Supplier Footprint: 0402; JLCPCB Part Class: Basic Part; Datasheet: https://item.szlcsc.com/datasheet/0402CG200J500NT/1906.html; Supplier: LCSC; Tolerance: ±5%; Voltage Rating: 50V; Temperature Coefficient: C0G
C45-C49 = CL05B104KO5NNNC: LCSC Part Name: 100nF ±10% 16V; Supplier Part: C1525; Manufacturer: SAMSUNG(三星); Supplier Footprint: 0402; JLCPCB Part Class: Basic Part; Datasheet: https://item.szlcsc.com/datasheet/CL05B104KO5NNNC/1877.html; Supplier: LCSC; Tolerance: ±10%; Voltage Rating: 16V; Temperature Coefficient: X7R
R15 = 0402WGF1004TCE: LCSC Part Name: 1MΩ ±1% 62.5mW 厚膜电阻; Supplier Part: C26083; Manufacturer: UNI-ROYAL(厚声); Supplier Footprint: 0402; JLCPCB Part Class: Basic Part; Datasheet: https://item.szlcsc.com/datasheet/0402WGF1004TCE/26826.html; Supplier: LCSC; Type: Thick Film Resistor; Tolerance: ±1%; Power(Watts): 62.5mW; Voltage-Supply(Max): 50V; Temperature Coefficient: ±100ppm/℃; Operating Temperature: -55℃~+155℃
U51 = STM32F103RCT6: LCSC Part Name: 主流增强型ARM Cortex-M3 MCU，具有256 KB Flash、72 MHz CPU、电机控制、USB和CAN; Supplier Part: C8323; Manufacturer: ST(意法半导体); Supplier Footprint: LQFP-64(10x10); JLCPCB Part Class: Extended Part; Datasheet: https://item.szlcsc.com/datasheet/STM32F103RCT6/8815.html; Supplier: LCSC; CPU Core: ARM-M3; CPU Maximum Speed: 72MHz; Program Storage Size: 256KB; Program Memory Type: FLASH; Number of I/O: 51; ADC (Bit): 12bit; DAC (Bit): 12bit; Voltage - Supply: 2V~3.6V
X2 = X49SM8MSD2SC: LCSC Part Name: HC-49SMD 8MHZ 20PF ±20PPM -20~70℃（±30PPM）; Supplier Part: C12674; Manufacturer: YXC(扬兴晶振); Supplier Footprint: HC-49S-SMD; JLCPCB Part Class: Basic Part; Datasheet: https://item.szlcsc.com/datasheet/X49SM8MSD2SC/13310.html; Supplier: LCSC; Type: Crystal Oscillator; Normal temperature Frequency Tolerance: ±20ppm; Load Capacitance: 20pF; Frequency Stability: ±30ppm; Operating Temperature: -20℃~+70℃
X3 = TAXD32768K2BGBBZT2S: LCSC Part Name: 32.768kHz ±10ppm 12.5pF; Supplier Part: C511702; Manufacturer: YJX(雅晶鑫); Supplier Footprint: DT-26; JLCPCB Part Class: Extended Part; Datasheet: https://item.szlcsc.com/datasheet/TAXD32768K2BGBBZT2S/526449.html; Supplier: LCSC; Type: Through Hole Crystal Oscillator; Normal temperature Frequency Tolerance: ±10ppm; Load Capacitance: 12.5pF; Frequency Stability: ±20ppm; Equivalent Series Resistance(ESR): 40kΩ; Operating Temperature: -20℃~+70℃
C16 = GRM155R61H224KE01D: LCSC Part Name: 220nF ±10% 50V; Supplier Part: C5159775; Manufacturer: muRata(村田); Supplier Footprint: 0402; JLCPCB Part Class: Extended Part; Datasheet: https://item.szlcsc.com/datasheet/GRM155R61H224KE01D/5803626.html; Supplier: LCSC; Tolerance: ±10%; Voltage Rating: 50V; Temperature Coefficient: X5R
C1-C7 C17 C22 C25-C34 C50 = CL05B104KB54PNC: LCSC Part Name: 100nF ±10% 50V; Supplier Part: C307331; Manufacturer: SAMSUNG(三星); Supplier Footprint: 0402; JLCPCB Part Class: Basic Part; Datasheet: https://item.szlcsc.com/datasheet/CL05B104KB54PNC/291005.html; Supplier: LCSC; Tolerance: ±10%; Voltage Rating: 50V; Temperature Coefficient: X7R
C19 = CL10A225KB8NNNC: LCSC Part Name: 2.2uF ±10% 50V; Supplier Part: C913904; Manufacturer: SAMSUNG(三星); Supplier Footprint: 0603; JLCPCB Part Class: Extended Part; Datasheet: https://item.szlcsc.com/datasheet/CL10A225KB8NNNC/984470.html; Supplier: LCSC; Tolerance: ±10%; Voltage Rating: 50V; Temperature Coefficient: X5R
C20 C21 = RVT1A221M0605_C72494: LCSC Part Name: 220uF ±20% 10V; Supplier Part: C72494; Manufacturer: ROQANG(容强); Manufacturer Part: RVT1A221M0605; Supplier Footprint: SMD,D6.3xL5.4mm; JLCPCB Part Class: Extended Part; Datasheet: https://atta.szlcsc.com/upload/public/pdf/source/20170325/1490427950282.pdf; Supplier: LCSC; Tolerance: ±20%; Voltage Rating: 10V; Ripple Current: 90mA@120Hz; Diameter: 6.3mm; Height - Seated (Max): 5.4mm; Lifetime: 2000hrs@105℃; Operating Temperature: -40℃~+105℃
C23 = 0402CG470J500NT: LCSC Part Name: 47pF ±5% 50V; Supplier Part: C1567; Manufacturer: FH(风华); Supplier Footprint: 0402; JLCPCB Part Class: Basic Part; Datasheet: https://item.szlcsc.com/datasheet/0402CG470J500NT/1919.html; Supplier: LCSC; Tolerance: ±5%; Voltage Rating: 50V; Temperature Coefficient: C0G
C24 = CC0402KRX7R9BB332: LCSC Part Name: 3.3nF ±10% 50V; Supplier Part: C107028; Manufacturer: YAGEO(国巨); Supplier Footprint: 0402; JLCPCB Part Class: Extended Part; Datasheet: https://item.szlcsc.com/datasheet/CC0402KRX7R9BB332/108244.html; Supplier: LCSC; Tolerance: ±10%; Voltage Rating: 50V; Temperature Coefficient: X7R
D1-D5 = SMF60CA_C41376092: LCSC Part Name: 双向TVS 60V截止 峰值浪涌电流：2.1A; Supplier Part: C41376092; Manufacturer: R+O(宏嘉诚); Supplier Footprint: SOD-123FL; JLCPCB Part Class: Extended Part; Datasheet: https://item.szlcsc.com/datasheet/SMF60CA/43144809.html; Supplier: LCSC; Polarity: Bidirectional; Reverse Stand-Off Voltage (Vrwm): 60V; Clamping Voltage: 96.8V; Peak Pulse Current (Ipp): 2.1A; Peak Pulse Power Dissipation (Ppp): 200W; Voltage - Breakdown: 73.7V; Reverse Leakage Current (Ir): 1uA; Number of Channels: 2; Operating Temperature: -55℃~+150℃; level of protection: IEC 61000-4-2; Type: TVS
D6 = ES1B-13-F: LCSC Part Name: 耐压:100V 电流:1A 反向恢复时间：25ns; Supplier Part: C106868; Manufacturer: DIODES(美台); Supplier Footprint: SMA; JLCPCB Part Class: Extended Part; Datasheet: https://item.szlcsc.com/datasheet/ES1B-13-F/108084.html; Supplier: LCSC; Voltage - Forward(Vf@If): 920mV@1A; Voltage - DC Reverse(Vr): 100V; Current - Rectified: 1A; Reverse Leakage Current (Ir): 5uA@100V; Reverse Recovery Time (trr): 25ns; Operating Junction Temperature Range: -55℃~+150℃; Non-Repetitive Peak Forward Surge Current: 30A
D15 = MM3Z3V3ST1G: LCSC Part Name: 独立式 耐压:3.3V 电流:5uA@1.0V; Supplier Part: C182011; Manufacturer: onsemi(安森美); Supplier Footprint: SOD-323; JLCPCB Part Class: Extended Part; Datasheet: https://item.szlcsc.com/datasheet/MM3Z3V3ST1G/193409.html; Supplier: LCSC; Diode Configuration: 1 Independent; Zener Voltage(Nom): 3.3V; Reverse Leakage Current (Ir): 5uA@1V; Zener Voltage(Range): 3.32V~3.53V; Pd - Power Dissipation: 300mW; Impedance(Zzt): 95Ω; Impedance(Zzk): 1kΩ; Operating Junction Temperature Range: -65℃~+150℃
F1 = 0466.500NRHF: LCSC Part Name: 63V贴片式保险丝; Supplier Part: C151133; Manufacturer: Littelfuse(美国力特); Supplier Footprint: 1206; JLCPCB Part Class: Extended Part; Datasheet: https://item.szlcsc.com/datasheet/0466.500NRHF/162473.html; Supplier: LCSC; Type: Surface Mount Fuse; Current Rating: 500mA; Voltage Rating (AC): 63V; Voltage Rating (DC): 63V; Operating Temperature: -55℃~+90℃; Interrupt Rating: 50A
H25 = PZ254V-11-05P: LCSC Part Name: 1x5P 间距:2.54mm 方针 直插; Supplier Part: C492404; Manufacturer: XFCN(兴飞); Supplier Footprint: 插件,P=2.54mm; JLCPCB Part Class: Extended Part; Datasheet: https://item.szlcsc.com/datasheet/PZ254V-11-05P/502960.html; Supplier: LCSC; Pin Structure: 1x5P; Pitch: 2.54mm; Circluar Pins/Square Pins: Pin Header; Mounting Type: Through Hole; Number of Rows: 1; Number of Pins: 5P; Current Rating: 3A; Voltage Rating (Max): 250V; Length of Mating Pin: 6mm; Insulation Height: 2.5mm; Length of End Connection Pin: 3mm; Contact Material: Brass; Operating Temperature: -40℃~+105℃; Color: Black
H26 = PZ254V-11-04P: LCSC Part Name: 1x4P 间距:2.54mm 方针 直插; Supplier Part: C2691448; Manufacturer: XFCN(兴飞); Supplier Footprint: 插件,P=2.54mm; JLCPCB Part Class: Extended Part; Datasheet: https://item.szlcsc.com/datasheet/PZ254V-11-04P/2801085.html; Supplier: LCSC; Pin Structure: 1x4P; Pitch: 2.54mm; Circluar Pins/Square Pins: Pin Header; Mounting Type: Through Hole; Number of Rows: 1; Number of Pins: 4P; Current Rating: 3A; Voltage Rating (Max): 250V; Length of Mating Pin: 6mm; Insulation Height: 2.5mm; Length of End Connection Pin: 3mm; Operating Temperature: -40℃~+105℃; Color: Black
L1 = CY54-6.8UH: LCSC Part Name: 6.8uH ±20%; Supplier Part: C2929430; Manufacturer: SHOU HAN(首韩); Supplier Footprint: SMD,5.8x5.2mm; JLCPCB Part Class: Extended Part; Datasheet: https://item.szlcsc.com/datasheet/CY54-6.8UH/3264912.html; Supplier: LCSC; Tolerance: ±20%; Current Rating: 2.4A; DC Resistance(DCR): 58.5mΩ
R77 = 0603WAJ0000T5E: LCSC Part Name: 0Ω ±5% 100mW 厚膜电阻; Supplier Part: C15402; Manufacturer: UNI-ROYAL(厚声); Supplier Footprint: 0603; JLCPCB Part Class: Extended Part; Datasheet: https://item.szlcsc.com/datasheet/0603WAJ0000T5E/16080.html; Supplier: LCSC; Type: Thick Film Resistor; Tolerance: ±5%; Power(Watts): 100mW; Voltage-Supply(Max): 75V; Temperature Coefficient: ±800ppm/℃; Operating Temperature: -55℃~+155℃
R78 = RC0402FR-07115KL: LCSC Part Name: 厚膜电阻 115kΩ ±1% 62.5mW; Supplier Part: C273341; Manufacturer: YAGEO(国巨); Supplier Footprint: 0402; JLCPCB Part Class: Extended Part; Datasheet: https://atta.szlcsc.com/upload/public/pdf/source/20180821/C275644_0D56F95EFF785E7D9A1FEF436B37DA78.pdf; Supplier: LCSC; Type: Thick Film Resistors; Tolerance: ±1%; Temperature Coefficient: ±100ppm/℃; Operating Temperature Range: -55℃~+155℃
R79 = 0402WGF2202TCE: LCSC Part Name: 22kΩ ±1% 62.5mW 厚膜电阻; Supplier Part: C25768; Manufacturer: UNI-ROYAL(厚声); Supplier Footprint: 0402; JLCPCB Part Class: Basic Part; Datasheet: https://item.szlcsc.com/datasheet/0402WGF2202TCE/26511.html; Supplier: LCSC; Type: Thick Film Resistor; Tolerance: ±1%; Power(Watts): 62.5mW; Voltage-Supply(Max): 50V; Temperature Coefficient: ±100ppm/℃; Operating Temperature: -55℃~+155℃
R80 = RC0402FR-0714KL: LCSC Part Name: 厚膜电阻 14kΩ ±1% 62.5mW; Supplier Part: C327372; Manufacturer: YAGEO(国巨); Supplier Footprint: 0402; JLCPCB Part Class: Extended Part; Datasheet: https://atta.szlcsc.com/upload/public/pdf/source/20181031/C327372_D664387651520BEEF49835DE044ADDF1.pdf; Supplier: LCSC; Type: Thick Film Resistors; Tolerance: ±1%; Temperature Coefficient: ±100ppm/℃; Operating Temperature Range: -55℃~+155℃
R81 = 0402WGF2003TCE: LCSC Part Name: 200kΩ ±1% 62.5mW 厚膜电阻; Supplier Part: C25764; Manufacturer: UNI-ROYAL(厚声); Supplier Footprint: 0402; JLCPCB Part Class: Basic Part; Datasheet: https://item.szlcsc.com/datasheet/0402WGF2003TCE/26507.html; Supplier: LCSC; Type: Thick Film Resistor; Tolerance: ±1%; Power(Watts): 62.5mW; Voltage-Supply(Max): 50V; Temperature Coefficient: ±100ppm/℃; Operating Temperature: -55℃~+155℃
R160 R161 = RC0402FR-076K8L: LCSC Part Name: 厚膜电阻 6.8kΩ ±1% 62.5mW; Supplier Part: C93940; Manufacturer: YAGEO(国巨); Supplier Footprint: 0402; JLCPCB Part Class: Extended Part; Datasheet: https://item.szlcsc.com/datasheet/RC0402FR-076K8L/95138.html; Supplier: LCSC; Type: Thick Film Resistor; Tolerance: ±1%; Power(Watts): 62.5mW; Voltage-Supply(Max): 50V; Temperature Coefficient: ±100ppm/℃; Operating Temperature: -55℃~+155℃
SW9 = SS12D07VG4 087: LCSC Part Name: SS12D07VG4; Supplier Part: C2939726; Manufacturer: SHOU HAN(首韩); Supplier Footprint: 插件,8.7x4.4mm; JLCPCB Part Class: Extended Part; Datasheet: https://item.szlcsc.com/datasheet/SS12D07VG4%2520087/3301205.html; Supplier: LCSC; Circuit: SPDT; Termination Style: PC Pin; Length: 8.7mm; Width: 4.4mm; Switch Height: 4.7mm; Mounting Type: Through Hole; Current Rating: 500mA; Voltage Rating: 50V; Life: 5,000 cycles; Operating Temperature: -10℃~+50℃
U31 = RVT1H331M1010_C3032175: LCSC Part Name: 330uF ±20% 50V; Supplier Part: C3032175; Manufacturer: ROQANG(容强); Manufacturer Part: RVT1H331M1010; Supplier Footprint: SMD,D10xL10.5mm; JLCPCB Part Class: Extended Part; Datasheet: https://item.szlcsc.com/datasheet/RVT1H331M1010/3571859.html; Supplier: LCSC; Tolerance: ±20%; Voltage Rating: 50V; Diameter: 10mm; Height - Seated (Max): 10.2mm; Lifetime: 2000hrs@105℃; Operating Temperature: -40℃~+105℃
U32 = AP64350SP-13: LCSC Part Name: 降压型 3.5A 3.8V~40V; Supplier Part: C2071691; Manufacturer: DIODES(美台); Supplier Footprint: SO-8-EP; JLCPCB Part Class: Extended Part; Datasheet: https://item.szlcsc.com/datasheet/AP64350SP-13/2163274.html; Supplier: LCSC; Function: Step-down type; Voltage - Supply: 3.8V~40V; Output Voltage: 800mV~39V; Output Current: 3.5A; Frequency - Switching: 100kHz~2.2MHz; Operating Temperature: -40℃~+125℃; Synchronous Rectifier: Yes; Number of Outputs: 1; Topology: Buck; Quiescent Current: 22uA; Switch tube (built-in/external): Built-in; Output Type: Adjustable; Features: Light load efficient mode；External compensation；Frequency synchronization；Cycle-by-cycle current limiting；Overcurrent Protection；EMI optimization (spread spectrum)；Hiccup current limiting
U33 = AP7313-18SAG-7: LCSC Part Name: 1.8V 150mA 6V; Supplier Part: C460373; Manufacturer: DIODES(美台); Supplier Footprint: SOT-23; JLCPCB Part Class: Extended Part; Datasheet: https://item.szlcsc.com/datasheet/AP7313-18SAG-7/464802.html; Supplier: LCSC; Output Configuration: Positive; Voltage - Supply: 6V; Output Voltage: 1.8V; Output Current: 150mA; Power Supply Rejection Ratio (PSRR): 65dB@(100Hz); Voltage Dropout: 300mV@(150mA); standby current: 65uA; Features: Over Current Protection；Short Circuit Protection；Thermal shutdown; Operating Temperature: -40℃~+85℃@(Ta); Output Type: Fixed; Number of Outputs: 1
C12-C15 = CC0603JRX7R9BB103: LCSC Part Name: 10nF ±5% 50V; Supplier Part: C115056; Manufacturer: YAGEO(国巨); Supplier Footprint: 0603; JLCPCB Part Class: Extended Part; Datasheet: https://item.szlcsc.com/datasheet/CC0603JRX7R9BB103/116301.html; Supplier: LCSC; Tolerance: ±5%; Voltage Rating: 50V; Temperature Coefficient: X7R
LED9-LED12 = KT-0603R: LCSC Part Name: 0603 红灯 高亮; Supplier Part: C2286; Manufacturer: KENTO; Supplier Footprint: 0603; JLCPCB Part Class: Basic Part; Datasheet: https://item.szlcsc.com/datasheet/KT-0603R/2659.html; Supplier: LCSC; Lamp Holder Type: 1.6mm x 0.8mm square LED; Illumination Color: Red; Voltage - Forward(Vf): 1.8V~2.4V; Power(Watts): 40mW; Forward Current: 20mA; Wavelength - Dominant: 615nm~630nm; Peak Wavelength: 645nm; Diode Configuration: Discrete Diode; Lens Color: Water Clear; Luminous Intensity: 300mcd; Viewing Angle: 120°; Operating Temperature: -40℃~+85℃
R57 R61 R65 R69 = 0603WAF3300T5E: LCSC Part Name: 330Ω ±1% 100mW 厚膜电阻; Supplier Part: C23138; Manufacturer: UNI-ROYAL(厚声); Supplier Footprint: 0603; JLCPCB Part Class: Basic Part; Datasheet: https://atta.szlcsc.com/upload/public/pdf/source/20200306/C422600_1E6D84923E4A46A82E41ADD87F860B5C.pdf; Supplier: LCSC; Type: Thick Film Resistors; Tolerance: ±1%; Temperature Coefficient: ±100ppm/℃; Operating Temperature Range: -55℃~+155℃
R58 R62 R66 R70 = 0603WAF1000T5E: LCSC Part Name: 100Ω ±1% 100mW 厚膜电阻; Supplier Part: C22775; Manufacturer: UNI-ROYAL(厚声); Supplier Footprint: 0603; JLCPCB Part Class: Basic Part; Datasheet: https://atta.szlcsc.com/upload/public/pdf/source/20200306/C422600_1E6D84923E4A46A82E41ADD87F860B5C.pdf; Supplier: LCSC; Type: Thick Film Resistors; Tolerance: ±1%; Temperature Coefficient: ±200ppm/℃; Operating Temperature Range: -55℃~+155℃
R59 R63 R67 R71 = 0603WAF1001T5E: LCSC Part Name: 1kΩ ±1% 100mW 厚膜电阻; Supplier Part: C21190; Manufacturer: UNI-ROYAL(厚声); Supplier Footprint: 0603; JLCPCB Part Class: Basic Part; Datasheet: https://item.szlcsc.com/datasheet/0603WAF1001T5E/21904.html; Supplier: LCSC; Type: Thick Film Resistor; Tolerance: ±1%; Power(Watts): 100mW; Voltage-Supply(Max): 75V; Temperature Coefficient: ±100ppm/℃; Operating Temperature: -55℃~+155℃
R60 R64 R68 R72 = 0603WAF2200T5E: LCSC Part Name: 220Ω ±1% 100mW 厚膜电阻; Supplier Part: C22962; Manufacturer: UNI-ROYAL(厚声); Supplier Footprint: 0603; JLCPCB Part Class: Basic Part; Datasheet: https://atta.szlcsc.com/upload/public/pdf/source/20200306/C422600_1E6D84923E4A46A82E41ADD87F860B5C.pdf; Supplier: LCSC; Type: Thick Film Resistors; Tolerance: ±1%; Temperature Coefficient: ±100ppm/℃; Operating Temperature Range: -55℃~+155℃
R156-R159 = 0603WAF4700T5E: LCSC Part Name: 470Ω ±1% 100mW 厚膜电阻; Supplier Part: C23179; Manufacturer: UNI-ROYAL(厚声); Supplier Footprint: 0603; JLCPCB Part Class: Basic Part; Datasheet: https://item.szlcsc.com/datasheet/0603WAF4700T5E/23906.html; Supplier: LCSC; Type: Thick Film Resistor; Tolerance: ±1%; Power(Watts): 100mW; Voltage-Supply(Max): 75V; Temperature Coefficient: ±100ppm/℃; Operating Temperature: -55℃~+155℃
TR1-TR4 = Z0107MN 5AA4: LCSC Part Name: 1A三端双向可控硅; Supplier Part: C71218; Manufacturer: ST(意法半导体); Supplier Footprint: SOT-223; JLCPCB Part Class: Extended Part; Datasheet: https://item.szlcsc.com/datasheet/Z0107MN%25205AA4/72317.html; Supplier: LCSC; Peak off - state voltage(Vdrm): 600V; Current - On State(It(RMS)): 1A; Current - Surge(Itsm@f): 8A@50Hz; Average Gate Power Dissipation (PG(AV)): 1W; Voltage - On State(Vtm): 1.6V; Current - Gate Trigger(Igt): 5mA; Gate Trigger   Voltage (Vgt): 1.3V; Holding Current (Ih): 10mA; Operating Temperature: -40℃~+125℃
U25-U28 = CTM3053(T1): LCSC Part Name: 双向可控硅 无过零电路 1通道; Supplier Part: C453470; Manufacturer: CT MICRO; Supplier Footprint: SOP-4-2.54mm; JLCPCB Part Class: Extended Part; Datasheet: https://atta.szlcsc.com/upload/public/pdf/source/20191108/C453470_DA584F87D99F387FEC7421CDFD08A9D4.pdf; Supplier: LCSC; SCR Type: Two-way thyristor; Zero Crossing Circuit: None; Forward Voltage: 1.5V; Isolation Voltage(rms): 3.75kV; Forward Current: 60mA; Load Voltage: 600V; Static dv/dt: 1000V/us; Number of Outputs: 1; Operating Temperature: -55℃~+100℃
H1-H16 = PZ254V-12-6P: LCSC Part Name: 间距:2.54mm 2x3P 直插 方针; Supplier Part: C492420; Manufacturer: XFCN(兴飞); Supplier Footprint: 插件,P=2.54mm; JLCPCB Part Class: Extended Part; Datasheet: https://atta.szlcsc.com/upload/public/pdf/source/20200309/C492420_BAECB307B001054C09D200388220EAE6.pdf; Supplier: LCSC; Pin Structure: 2x3P; Pitch: 2.54mm; Row Spacing: 2.54mm; Circluar Pins/Square Pins: Square Pins; Mounting Type: Straight; Number of Rows: 双排; Number of Pins: 6P; Length of Mating Pin: 6mm; Insulation Height: 2.5mm; Length of End Connection Pin: 3mm; Operating Temperature Range: -40℃~+105℃; Color: Black
R2 R6 R10 R14 R18 R22 R26 R84 R88 R92 R96 R100 R104 R108 R112 R116 = 0402WGF4701TCE: LCSC Part Name: 4.7kΩ ±1% 62.5mW 厚膜电阻; Supplier Part: C25900; Manufacturer: UNI-ROYAL(厚声); Supplier Footprint: 0402; JLCPCB Part Class: Basic Part; Datasheet: https://item.szlcsc.com/datasheet/0402WGF4701TCE/26643.html; Supplier: LCSC; Type: Thick Film Resistor; Tolerance: ±1%; Power(Watts): 62.5mW; Voltage-Supply(Max): 50V; Temperature Coefficient: ±100ppm/℃; Operating Temperature: -55℃~+155℃
R138-R153 = RC0402JR-07150RL: LCSC Part Name: 厚膜电阻 150Ω ±5% 62.5mW; Supplier Part: C137918; Manufacturer: YAGEO(国巨); Supplier Footprint: 0402; JLCPCB Part Class: Extended Part; Datasheet: https://item.szlcsc.com/datasheet/RC0402JR-07150RL/149234.html; Supplier: LCSC; Type: Thick Film Resistor; Tolerance: ±5%; Power(Watts): 62.5mW; Voltage-Supply(Max): 50V; Temperature Coefficient: ±100ppm/℃; Operating Temperature: -55℃~+155℃
U1-U7 U34-U42 = CDBU0130-HF: LCSC Part Name: 电压:30V 电流:100mA; Supplier Part: C2886021; Manufacturer: Comchip(典琦); Supplier Footprint: SOD-523F; JLCPCB Part Class: Extended Part; Datasheet: https://item.szlcsc.com/datasheet/CDBU0130-HF/3097060.html; Supplier: LCSC; Diode Configuration: Independent; Voltage - Forward(Vf@If): 440mV@100mA; Voltage - DC Reverse(Vr): 30V; Current - Rectified: 100mA; Reverse Leakage Current (Ir): 30uA@30V

## Nets
3V3: C45.2 C46.2 C47.2 C48.2 C49.2 R74.2 R75.2 R154.2 U29.6(VCC) U30.6(VCC) U51.13(VDDA) U51.19(VDD_4) U51.32(VDD_1) U51.48(VDD_2) U51.64(VDD_3) ; also on sheet 8
5V0: C20.1 C21.1 C25.2 L1.2 LED9.1(A) LED10.1(A) LED11.1(A) LED12.1(A) R57.2 R61.2 R65.2 R69.2 R73.2 R76.2 R78.2 U33.1(IN) ; also on sheet 8
24VAC: SW9.2
24VAC_SW: R58.1 R59.1 R62.1 R63.1 R66.1 R67.1 R70.1 R71.1 R77.1 SW9.3 TR1.1(M1) TR2.1(M1) TR3.1(M1) TR4.1(M1) ; also on sheet 8
24VURDC: C16.2 C17.2 D6.1(K) R160.2 R161.2 U8.4(VCC) U31.1 U32.2(VIN) U50.4(VCC)
GND: C1.1 C2.1 C3.1 C4.1 C5.1 C6.1 C7.1 C8.1 C9.1 C10.1 C11.1 C18.1 C19.1 C20.2 C21.2 C23.1 C24.1 C25.1 C26.1 C27.1 C28.1 C29.1 C30.1 C31.1 C32.1 C33.1 C34.1 C35.1 C36.1 C37.1 C38.1 C40.1 C41.1 C42.1 C43.1 C44.1 C45.1 C46.1 C47.1 C48.1 C49.1 C50.1 C51.1 D15.2 H1.4 H1.6 H2.4 H2.6 H3.4 H3.6 H4.4 H4.6 H5.4 H5.6 H6.4 H6.6 H7.4 H7.6 H8.4 H8.6 H9.4 H9.6 H10.4 H10.6 H11.4 H11.6 H12.4 H12.6 H13.4 H13.6 H14.4 H14.6 H15.4 H15.6 H16.4 H16.6 H25.2 H26.2 R33.1 R38.1 R43.1 R48.1 R79.1 R81.1 R122.1 R127.1 R132.1 R137.1 R155.1 U1.2(A) U2.2(A) U3.2(A) U4.2(A) U5.2(A) U6.2(A) U7.2(A) U8.11(VEE) U9.2(-) U10.2(-) U11.2(-) U12.2(-) U32.7(GND) U33.3(GND) U34.2(A) U35.2(A) U36.2(A) U37.2(A) U38.2(A) U39.2(A) U40.2(A) U41.2(A) U42.2(A) U43.2(-) U45.2(-) U47.2(-) U49.2(-) U50.11(VEE) U51.12(VSSA) U51.18(VSS_4) U51.31(VSS_1) U51.47(VSS_2) U51.63(VSS_3) ; also on sheet 8
VDD_WDT: C50.2 C51.2 D15.1 H25.1 H26.1 R160.1 R161.1
A01: R31.2 R32.1
A02: R36.2 R37.1
A03: R41.2 R42.1
A04: R46.2 R47.1 ; also on sheet 8
A05: R120.2 R121.1
A06: R125.2 R126.1
A07: R130.2 R131.1
A08: R135.2 R136.1
ANALOG_VDD: C19.2 R4.2 R8.2 R12.2 R16.2 R20.2 R24.2 R28.2 R82.2 R86.2 R90.2 R94.2 R98.2 R102.2 R106.2 R110.2 R114.2 U33.2(OUT)
BB_FAST_DI1: R74.1 U29.4(VO) ; also on sheet 8
BB_FAST_DI2: R75.1 U30.4(VO) ; also on sheet 8
D: C16.1 C17.1 U29.5(GND) U30.5(GND) U31.2
EARTH_COM: CN3.1 CN3.2 D1.1(K) D2.1(K) D3.1(K) D4.1(K) D5.1(K) D7.1 D8.1 D9.1 D10.1 D11.1 D12.1 D13.1 D14.1 H17.2 H18.2 H19.2 H20.2 H21.2 H22.2 H23.2 H24.2
ENABLE: C18.2 H26.3 U32.3(EN)
FAST_DI1: U29.2(CAT) ; also on sheet 8
FAST_DI2: U30.2(CAT) ; also on sheet 8
MCU_BLINK: H26.4
NRST: H25.5
PWM1: R29.1 U51.41(PA8)
PWM2: R34.1 U51.42(PA9)
PWM3: R39.1 U51.43(PA10)
PWM4: R44.1 U51.44(PA11)
PWM5: R118.1 U51.45(PA12)
PWM6: R123.1 U51.46(PA13)
PWM7: R128.1 U51.49(PA14)
PWM8: R133.1 U51.50(PA15)
RL_COM1: CN4.2 D7.2 H17.1
RL_COM2: CN5.2 D8.2 H18.1
RL_COM3: CN6.2 D9.2 H19.1
RL_COM4: CN7.2 D10.2 H20.1
RL_COM5: CN8.2 D14.2 H24.1
RL_COM6: CN9.2 D13.2 H23.1
RL_COM7: CN10.2 D12.2 H22.1
RL_COM8: CN11.2 D11.2 H21.1
RL_NC1: CN4.1
RL_NC2: CN5.1
RL_NC3: CN6.1
RL_NC4: CN7.1
RL_NC5: CN8.1
RL_NC6: CN9.1
RL_NC7: CN10.1
RL_NC8: CN11.1
RL_NO1: CN4.3
RL_NO2: CN5.3
RL_NO3: CN6.3
RL_NO4: CN7.3
RL_NO5: CN8.3
RL_NO6: CN9.3
RL_NO7: CN10.3
RL_NO8: CN11.3
SWCLK: H25.4
SWDIO: H25.3
T1: C12.2 D1.2(A) TR1.2(M2) TR1.4(M2) U25.4(MT1)
T1_LED: R156.1 U25.2(Cathode)
T2: C13.2 D2.2(A) TR2.2(M2) TR2.4(M2) U26.4(MT1)
T2_LED: R157.1 U26.2(Cathode)
T3: C14.2 D3.2(A) TR3.2(M2) TR3.4(M2) U27.4(MT1)
T3_LED: R158.1 U27.2(Cathode)
T4: C15.2 D4.2(A) TR4.2(M2) TR4.4(M2) U28.4(MT1)
T4_LED: R159.1 U28.2(Cathode)
UA1: C1.2 R1.1 R2.1 U1.1(K) U51.14(PA0-WKUP)
UA2: C2.2 R5.1 R6.1 U2.1(K) U51.15(PA1)
UA3: C3.2 R9.1 R10.1 U3.1(K) U51.16(PA2)
UA4: C4.2 R13.1 R14.1 U4.1(K) U51.17(PA3)
UA5: C5.2 R17.1 R18.1 U5.1(K) U51.20(PA4)
UA6: C6.2 R21.1 R22.1 U6.1(K) U51.21(PA5)
UA7: C7.2 R25.1 R26.1 U7.1(K) U51.22(PA6)
UA8: C28.2 R84.1 R91.1 U36.1(K) U51.23(PA7)
UA9: C29.2 R88.1 R95.1 U37.1(K) U51.26(PB0)
UA10: C30.2 R92.1 R99.1 U38.1(K) U51.27(PB1)
UA11: C31.2 R96.1 R103.1 U39.1(K) U51.8(PC0)
UA12: C32.2 R100.1 R107.1 U40.1(K) U51.9(PC1)
UA13: C33.2 R104.1 R111.1 U41.1(K) U51.10(PC2)
UA14: C34.2 R108.1 R115.1 U42.1(K) U51.11(PC3)
UA15: C26.2 R83.1 R112.1 U34.1(K) U51.24(PC4)
UA16: C27.2 R87.1 R116.1 U35.1(K) U51.25(PC5)
UI1: H1.1 R1.2 R138.2
UI2: H2.1 R5.2 R139.2
UI3: H3.1 R9.2 R140.2
UI4: H4.1 R13.2 R141.2
UI5: H5.1 R17.2 R142.2
UI6: H6.1 R21.2 R143.2
UI7: H7.1 R25.2 R144.2 ; also on sheet 8
UI8: H10.1 R91.2 R145.2
UI9: H11.1 R95.2 R146.2
UI10: H12.1 R99.2 R147.2
UI11: H13.1 R103.2 R148.2
UI12: H14.1 R107.2 R149.2
UI13: H15.1 R111.2 R150.2
UI14: H16.1 R115.2 R151.2
UI15: H8.1 R83.2 R152.2
UI16: H9.1 R87.2 R153.2
Net-(C8-2): C8.2 R30.2 U8.3(IN1+)
Net-(C9-2): C9.2 R35.2 U8.5(IN2+)
Net-(C10-2): C10.2 R40.2 U8.10(IN3+)
Net-(C11-2): C11.2 R45.2 U8.12(IN4+)
Net-(C12-1): C12.1 R58.2
Net-(C13-1): C13.1 R62.2
Net-(C14-1): C14.1 R66.2
Net-(C15-1): C15.1 R70.2
Net-(C22-1): C22.1 L1.1 U32.8(SW)
Net-(C22-2): C22.2 U32.1(BST)
Net-(C23-2): C23.2 R80.2 U32.6(COMP)
Net-(C24-2): C24.2 R80.1
Net-(C35-2): C35.2 R119.2 U50.3(IN1+)
Net-(C36-2): C36.2 R124.2 U50.5(IN2+)
Net-(C37-2): C37.2 R129.2 U50.12(IN4+)
Net-(C38-2): C38.2 R134.2 U50.10(IN3+)
Net-(C40-2): C40.2 R154.1 U51.7(NRST)
Net-(C41-2): C41.2 R15.2 U51.5(PD0-OSC_IN) X2.1(OSC1)
Net-(C42-2): C42.2 R15.1 U51.6(PD1-OSC_OUT) X2.2(OSC2)
Net-(C43-2): C43.2 U51.4(PC15-OSC32_OUT) X3.1
Net-(C44-2): C44.2 U51.3(PC14-OSC32_IN) X3.2
Net-(D5-2): D5.2(A) D6.2(A) F1.2
Net-(F1-1): F1.1 R77.2
Net-(H1-2): H1.2 R4.1
Net-(H1-3): H1.3 R2.2
Net-(H1-5): H1.5 R138.1
Net-(H2-2): H2.2 R8.1
Net-(H2-3): H2.3 R6.2
Net-(H2-5): H2.5 R139.1
Net-(H3-2): H3.2 R12.1
Net-(H3-3): H3.3 R10.2
Net-(H3-5): H3.5 R140.1
Net-(H4-2): H4.2 R16.1
Net-(H4-3): H4.3 R14.2
Net-(H4-5): H4.5 R141.1
Net-(H5-2): H5.2 R20.1
Net-(H5-3): H5.3 R18.2
Net-(H5-5): H5.5 R142.1
Net-(H6-2): H6.2 R24.1
Net-(H6-3): H6.3 R22.2
Net-(H6-5): H6.5 R143.1
Net-(H7-2): H7.2 R28.1
Net-(H7-3): H7.3 R26.2
Net-(H7-5): H7.5 R144.1
Net-(H8-2): H8.2 R82.1
Net-(H8-3): H8.3 R112.2
Net-(H8-5): H8.5 R152.1
Net-(H9-2): H9.2 R86.1
Net-(H9-3): H9.3 R116.2
Net-(H9-5): H9.5 R153.1
Net-(H10-2): H10.2 R90.1
Net-(H10-3): H10.3 R84.2
Net-(H10-5): H10.5 R145.1
Net-(H11-2): H11.2 R94.1
Net-(H11-3): H11.3 R88.2
Net-(H11-5): H11.5 R146.1
Net-(H12-2): H12.2 R98.1
Net-(H12-3): H12.3 R92.2
Net-(H12-5): H12.5 R147.1
Net-(H13-2): H13.2 R102.1
Net-(H13-3): H13.3 R96.2
Net-(H13-5): H13.5 R148.1
Net-(H14-2): H14.2 R106.1
Net-(H14-3): H14.3 R100.2
Net-(H14-5): H14.5 R149.1
Net-(H15-2): H15.2 R110.1
Net-(H15-3): H15.3 R104.2
Net-(H15-5): H15.5 R150.1
Net-(H16-2): H16.2 R114.1
Net-(H16-3): H16.3 R108.2
Net-(H16-5): H16.5 R151.1
Net-(LED9-2): LED9.2(K) R156.2
Net-(LED10-2): LED10.2(K) R157.2
Net-(LED11-2): LED11.2(K) R158.2
Net-(LED12-2): LED12.2(K) R159.2
Net-(R29-2): R29.2 R30.1 U9.1(+)
Net-(R31-1): R31.1 R33.2 U8.2(IN1-)
Net-(R32-2): R32.2 U8.1(OUT1)
Net-(R34-2): R34.2 R35.1 U10.1(+)
Net-(R36-1): R36.1 R38.2 U8.6(IN2-)
Net-(R37-2): R37.2 U8.7(OUT2)
Net-(R39-2): R39.2 R40.1 U11.1(+)
Net-(R41-1): R41.1 R43.2 U8.9(IN3-)
Net-(R42-2): R42.2 U8.8(OUT3)
Net-(R44-2): R44.2 R45.1 U12.1(+)
Net-(R46-1): R46.1 R48.2 U8.13(IN4-)
Net-(R47-2): R47.2 U8.14(OUT4)
Net-(R57-1): R57.1 U25.1(Anode)
Net-(R59-2): R59.2 R60.2 TR1.3(G)
Net-(R60-1): R60.1 U25.3(MT2)
Net-(R61-1): R61.1 U26.1(Anode)
Net-(R63-2): R63.2 R64.2 TR2.3(G)
Net-(R64-1): R64.1 U26.3(MT2)
Net-(R65-1): R65.1 U27.1(Anode)
Net-(R67-2): R67.2 R68.2 TR3.3(G)
Net-(R68-1): R68.1 U27.3(MT2)
Net-(R69-1): R69.1 U28.1(Anode)
Net-(R71-2): R71.2 R72.2 TR4.3(G)
Net-(R72-1): R72.1 U28.3(MT2)
Net-(R73-1): R73.1 U29.1(AN)
Net-(R76-1): R76.1 U30.1(AN)
Net-(R78-1): R78.1 R79.2 U32.5(FB)
Net-(R81-2): R81.2 U32.4(RT/CLK)
Net-(R118-2): R118.2 R119.1 U43.1(+)
Net-(R120-1): R120.1 R122.2 U50.2(IN1-)
Net-(R121-2): R121.2 U50.1(OUT1)
Net-(R123-2): R123.2 R124.1 U45.1(+)
Net-(R125-1): R125.1 R127.2 U50.6(IN2-)
Net-(R126-2): R126.2 U50.7(OUT2)
Net-(R128-2): R128.2 R129.1 U47.1(+)
Net-(R130-1): R130.1 R132.2 U50.13(IN4-)
Net-(R131-2): R131.2 U50.14(OUT4)
Net-(R133-2): R133.2 R134.1 U49.1(+)
Net-(R135-1): R135.1 R137.2 U50.9(IN3-)
Net-(R136-2): R136.2 U50.8(OUT3)
Net-(R155-2): R155.2 U51.60(BOOT0)

Not connected (* = marked no-connect by the designer): SW9 1 4 5; U9 3(NC)*; U10 3(NC)*; U11 3(NC)*; U12 3(NC)*; U29 3(NC)*; U30 3(NC)*; U32 9(EP); U43 3(NC)*; U45 3(NC)*; U47 3(NC)*; U49 3(NC)*; U51 1(VBAT) 2(PC13-TAMPER-RTC) 28(PB2) 29(PB10) 30(PB11) 33(PB12) 34(PB13) 35(PB14) 36(PB15) 37(PC6) 38(PC7) 39(PC8) 40(PC9) 51(PC10) 52(PC11) 53(PC12) 54(PD2) 55(PB3) 56(PB4) 57(PB5) 58(PB6) 59(PB7) 61(PB8) 62(PB9)

## Notes on the sheets
sheet 1
- 16 Universal Input Channels
- 1-2: Thermistor
  3-4: 0-10 VDC
  5-6: 4-20 mA
- 1-2: Thermistor
  3-4: 0-10 VDC
  5-6: 4-20 mA
- 1-2: Thermistor
  3-4: 0-10 VDC
  5-6: 4-20 mA
- 1-2: Thermistor
  3-4: 0-10 VDC
  5-6: 4-20 mA
- 1-2: Thermistor
  3-4: 0-10 VDC
  5-6: 4-20 mA
- 1-2: Thermistor
  3-4: 0-10 VDC
  5-6: 4-20 mA
- 1-2: Thermistor
  3-4: 0-10 VDC
  5-6: 4-20 mA
- 1-2: Thermistor
  3-4: 0-10 VDC
  5-6: 4-20 mA
- 1-2: Thermistor
  3-4: 0-10 VDC
  5-6: 4-20 mA
- 1-2: Thermistor
  3-4: 0-10 VDC
  5-6: 4-20 mA
- 1-2: Thermistor
  3-4: 0-10 VDC
  5-6: 4-20 mA
- 1-2: Thermistor
  3-4: 0-10 VDC
  5-6: 4-20 mA
- 1-2: Thermistor
  3-4: 0-10 VDC
  5-6: 4-20 mA
- 1-2: Thermistor
  3-4: 0-10 VDC
  5-6: 4-20 mA
- 1-2: Thermistor
  3-4: 0-10 VDC
  5-6: 4-20 mA
- 1-2: Thermistor
  3-4: 0-10 VDC
  5-6: 4-20 mA
sheet 2
- 8 Analog Output Channels
